# Altium project Pleiades_P01.PrjPcb (part 1 of 10)
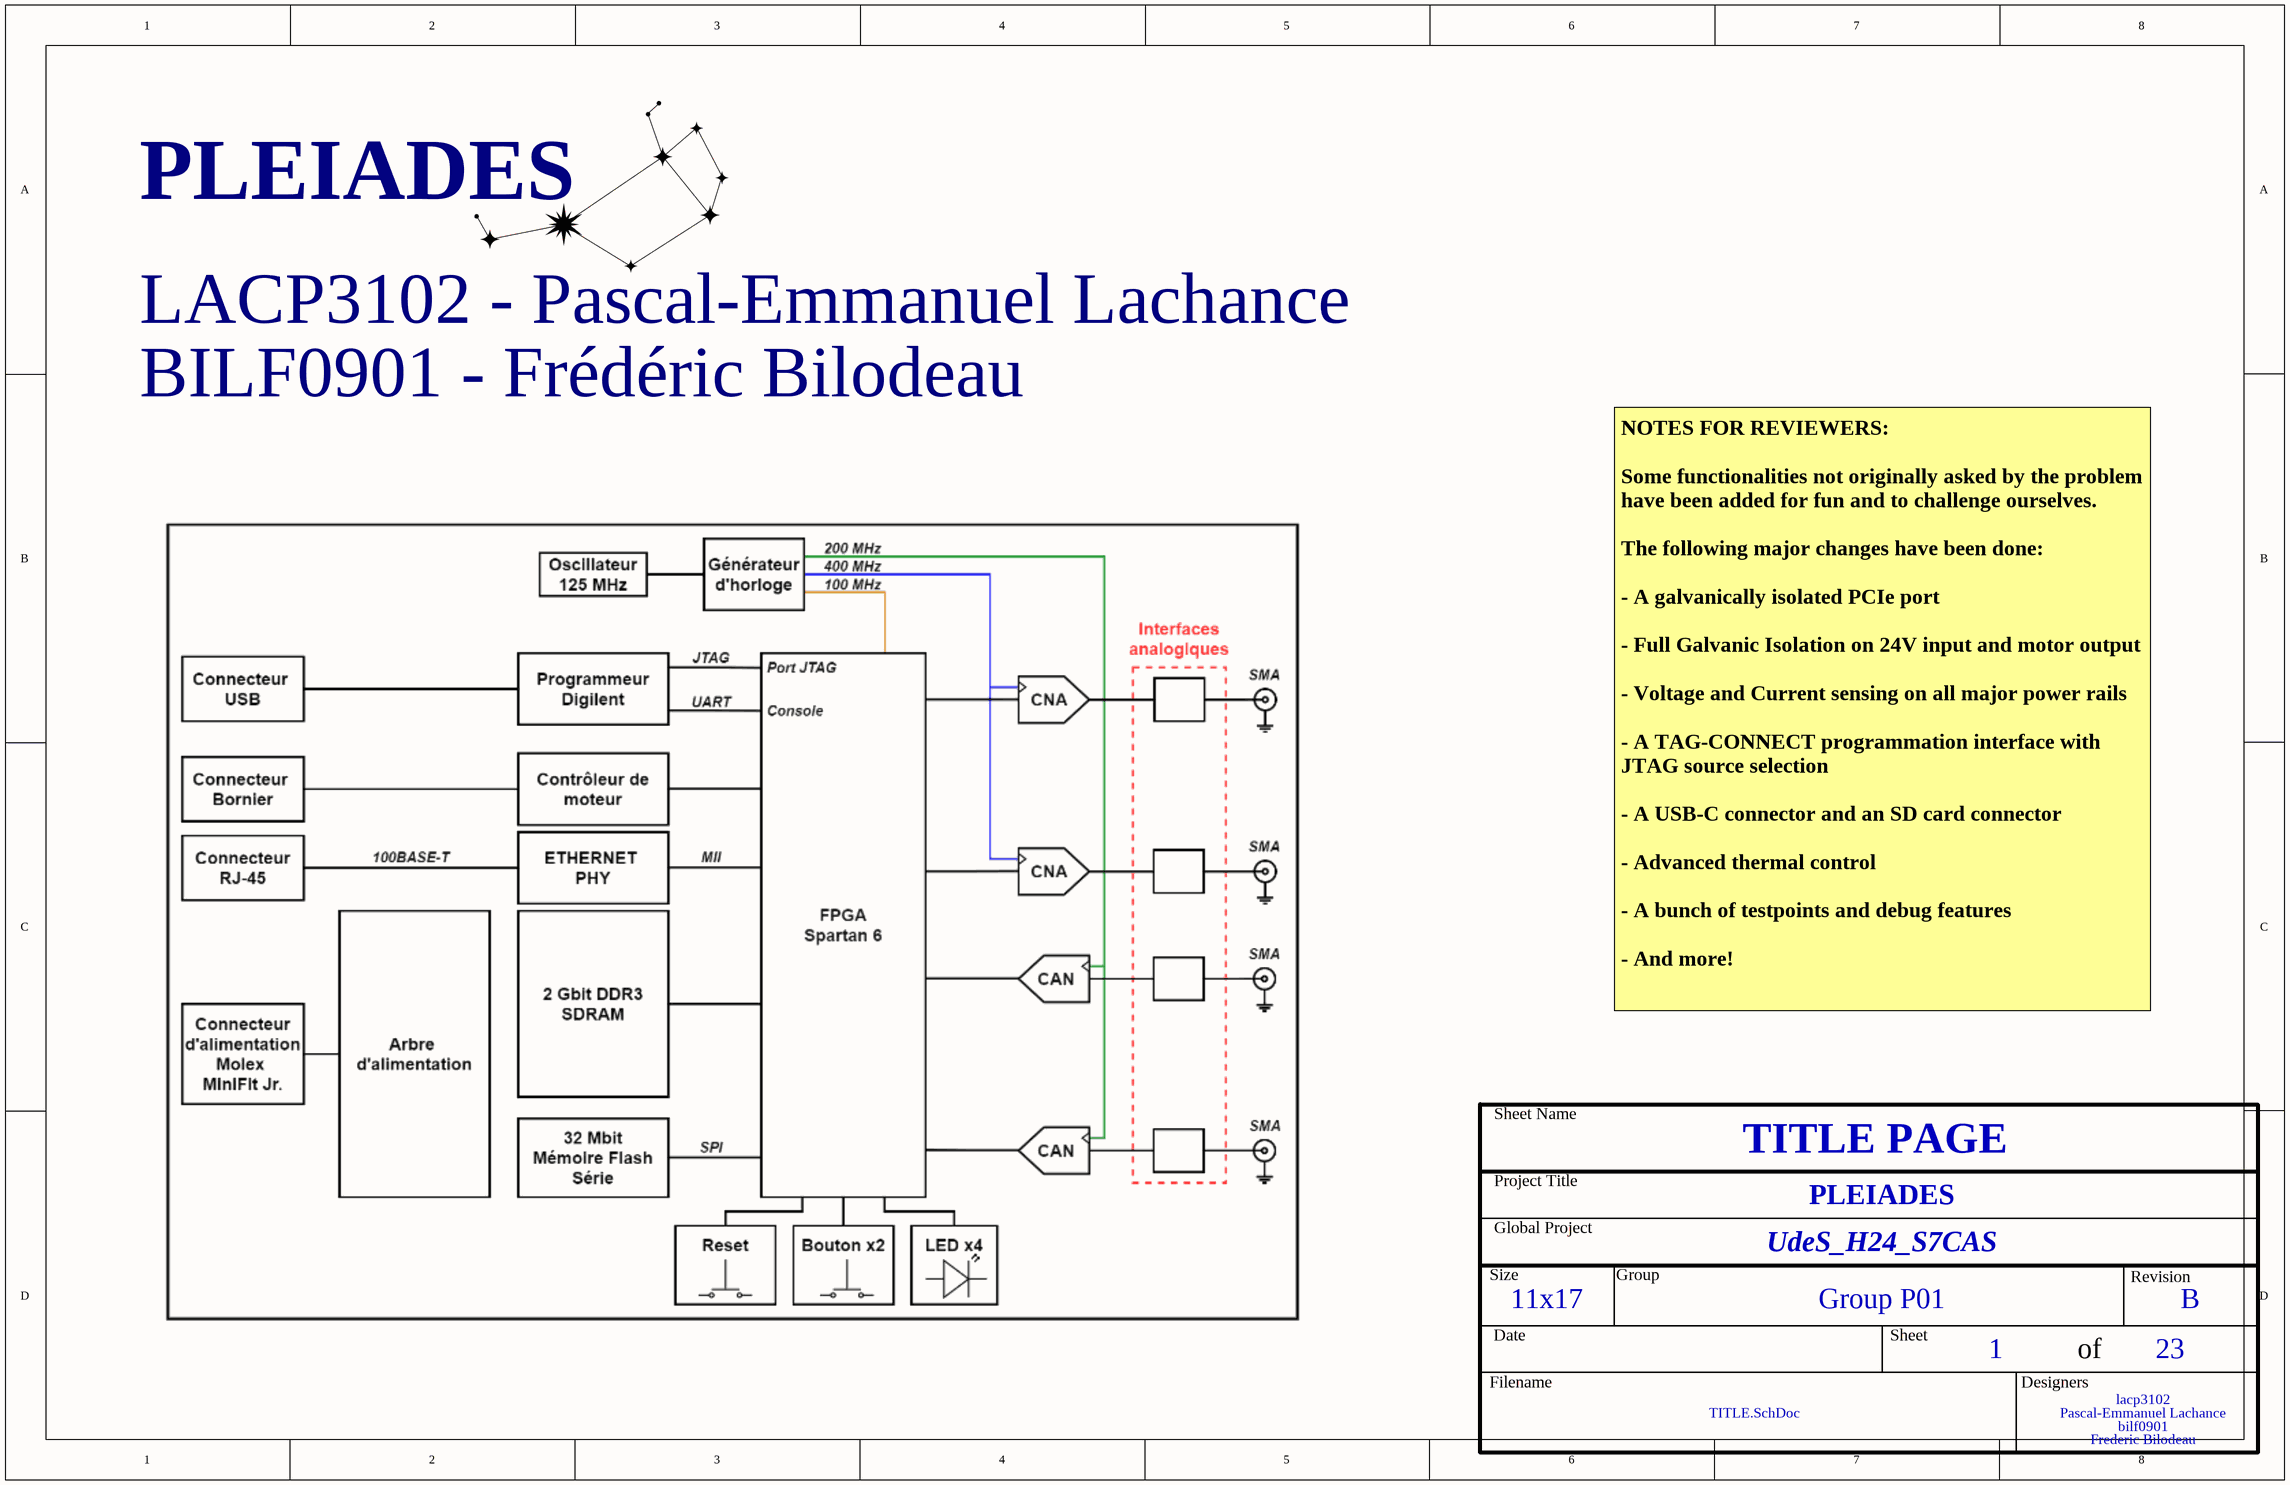
[diagram p0: TITLE.SchDoc]
Author: Pascal-Emmanuel Lachance; DOC_NO_ASSY_DWG: PCB_S7_DWG.PCBDwf; DOC_NO_BOM: PCB_S7_BOM.xslx; NotFitted: DNF; PCB_DWG_NO: PCB_S7.PcbDoc; Project: PLEIADES; Project_Date: =CurrentDate; Project_Designer1: lacp3102; Project_Designer2: Pascal-Emmanuel Lachance; Project_Designer3: bilf0901; Project_Designer4: Frederic Bilodeau; Project_Global: UdeS_H24_S7CAS; Project_Group: Group P01; Project_Name: PLEIADES; Project_Revision: B; Revision: B; SCH_SCALE: 1:1
25 sheets, 1537 parts. Net scope: hierarchical (ports join the sheet entries above them; power ports are global).
Board files: Pleiades_Frouf.PcbDoc, Pleiades_PP.PcbDoc
Sheets:
  TITLE.SchDoc
    Designator = INFO.SchDoc
    Designator = OVERVIEW.SchDoc
      MECHANICAL = MECHANICAL.SchDoc
      DDR3 = DDR3.SchDoc
      POWER = POWER.SchDoc
        POWER INPUT = POWER_INPUT.SchDoc
        FPGA POWER = POWER_FPGA.SchDoc
        DDR3 POWER = POWER_DDR3.SchDoc
        ANALOG POWER = POWER_ANALOG.SchDoc
        MOTOR POWER = POWER_MOTORS.SchDoc
        POWER_SENSING = POWER_SENSING.SchDoc
      PROM FLASH = PROM.SchDoc
      ADC = ADC.SchDoc
      DAC = DAC.SchDoc
      FPGA Misc = FPGA_MISC.SchDoc
      FPGA IOs = FPGA_IO.SchDoc
      MOTOR CONTROL = MOTOR_CONTROL.SchDoc
      USER IOs = USER_IO.SchDoc
      CLOCK = CLOCK.SchDoc
      USB = USB.SchDoc
      Ethernet = ETHERNET.SchDoc
      PCI = PCI.SchDoc
      SENSORS = SENSORS.SchDoc
      JTAG = JTAG.SchDoc

## Sheet TITLE.SchDoc
size Tabloid; SheetNumber: 1; SheetTotal: 23; Sheet_Name: TITLE PAGE; Size: 11x17

### Sub-sheets
Designator = INFO.SchDoc: no entries
Designator = OVERVIEW.SchDoc: no entries

### Notes on the sheet
- LACP3102 - Pascal-Emmanuel Lachance
- BILF0901 - Frédéric Bilodeau
- NOTES FOR REVIEWERS:
  Some functionalities not originally asked by the problem have been added for fun and to challenge ourselves.
  The following major changes have been done:
  - A galvanically isolated PCIe port
  - Full Galvanic Isolation on 24V input and motor output
  - Voltage and Current sensing on all major power rails
  - A TAG-CONNECT programmation interface with JTAG source selection
  - A USB-C connector and an SD card connector
  - Advanced thermal control
  - A bunch of testpoints and debug features
  - And more!
- Sheet Name
- Project Title
- Global Project
- Size
- Group
- Revision
- Date
- Sheet
- of
- Filename
- Designers

## Sheet INFO.SchDoc
size 558 x 431 mm; SheetNumber: 2; SheetTotal: 25; Sheet_Name: INFO; Size: 11x17
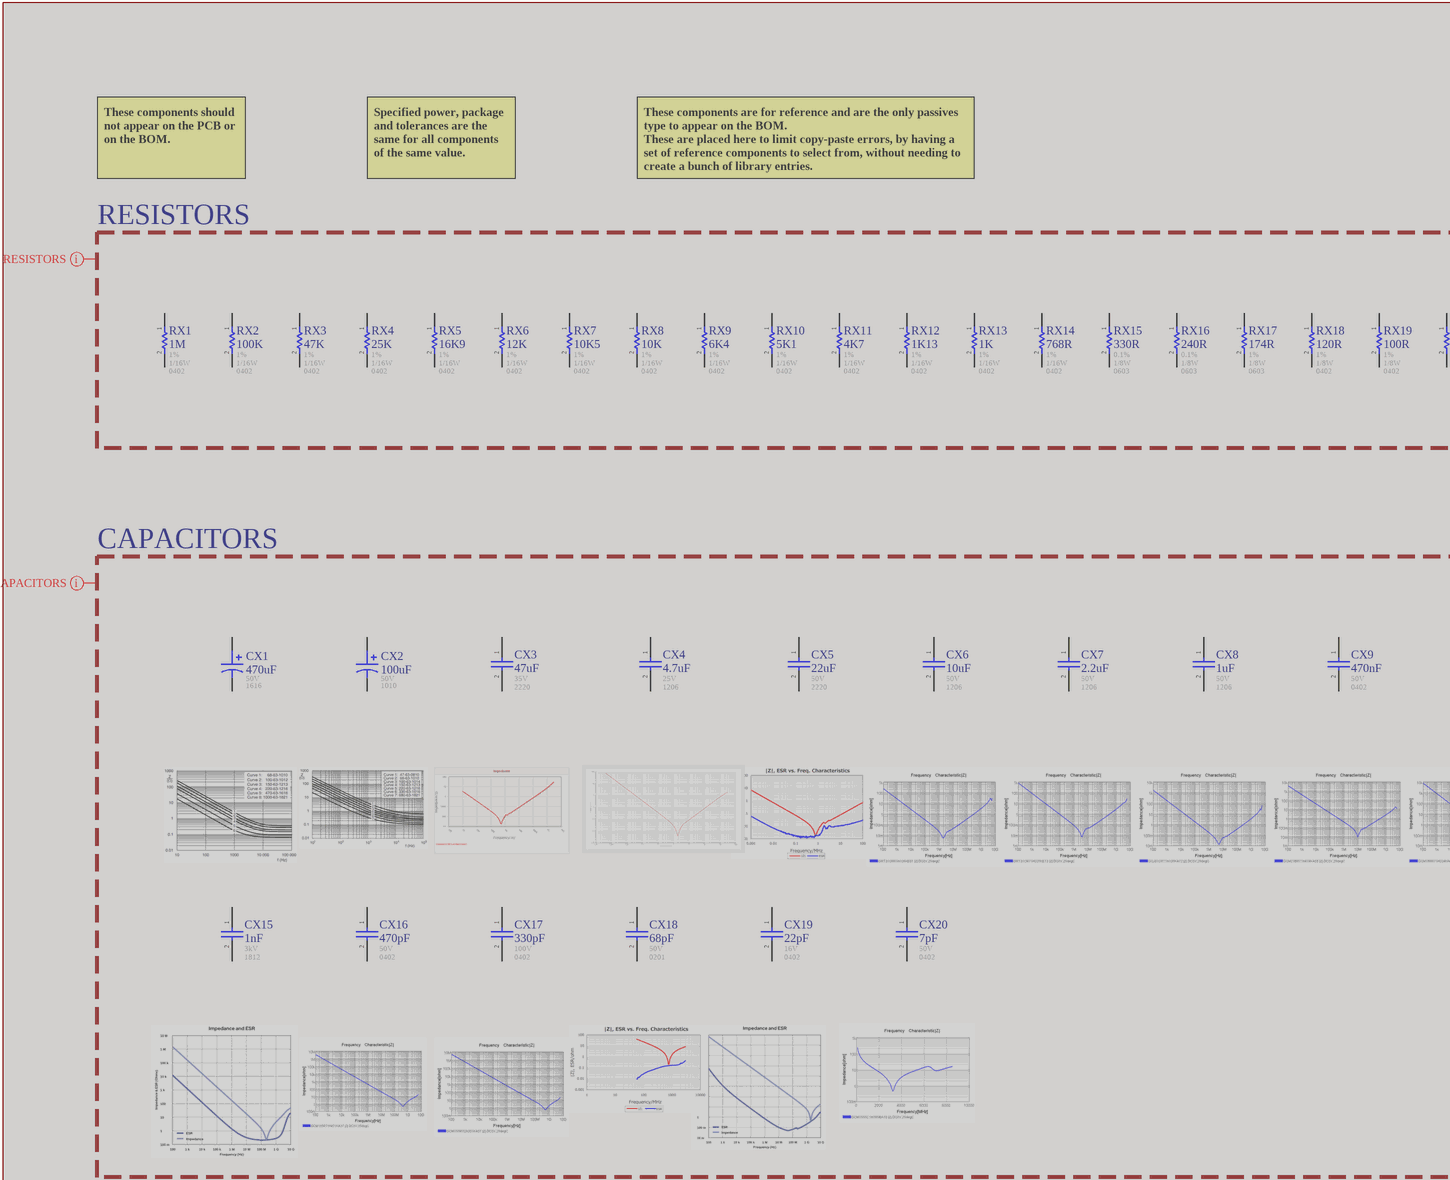
[diagram p1: INFO.SchDoc, top left]
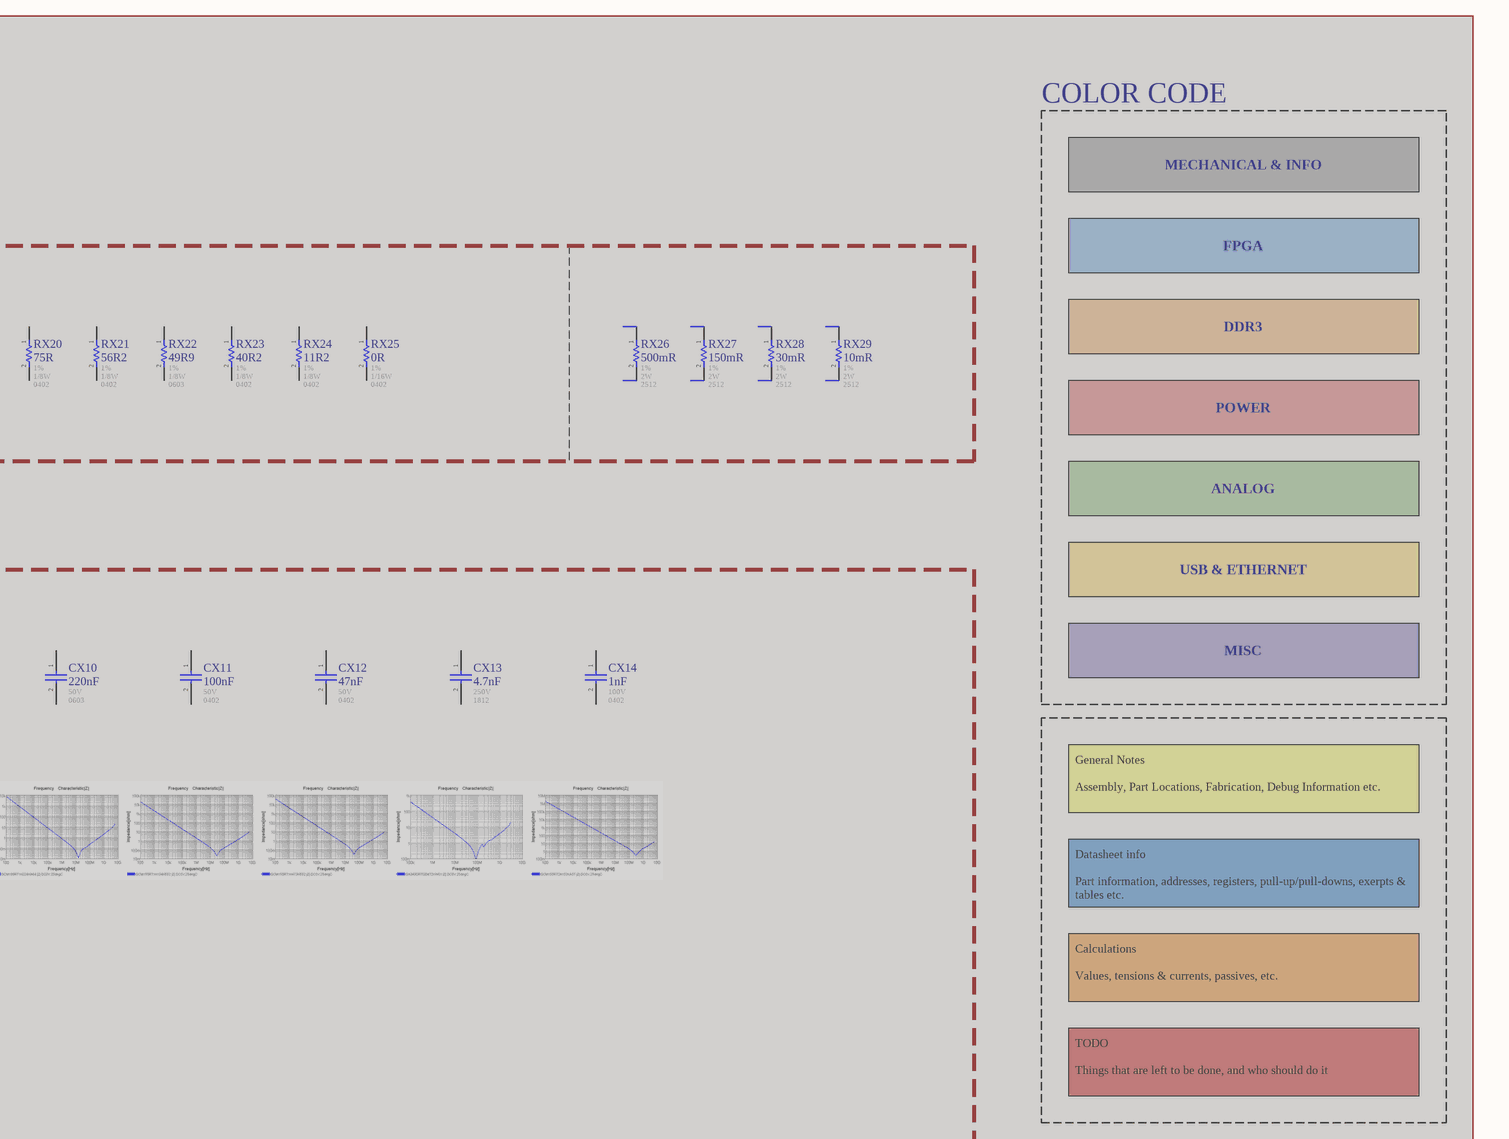
[diagram p2: INFO.SchDoc, top right]
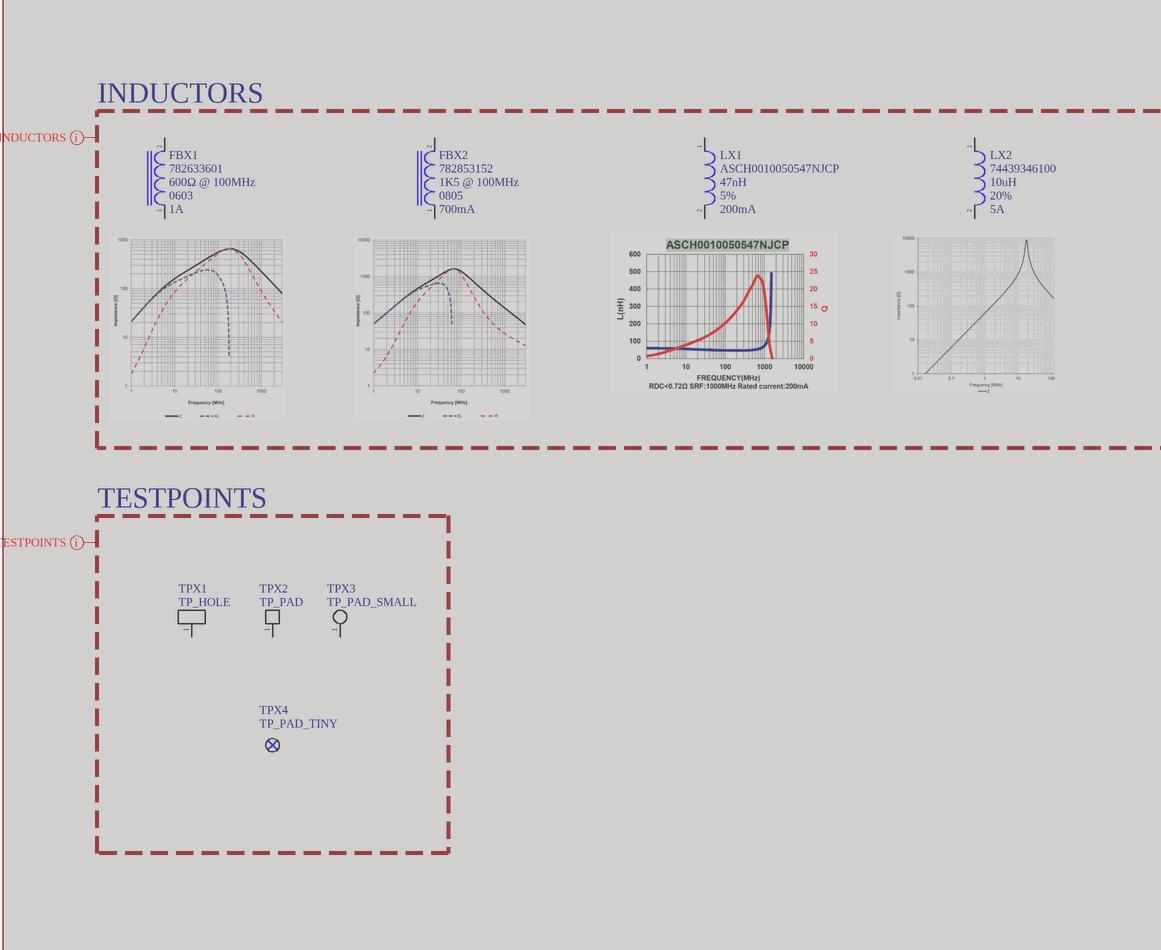
[diagram p3: INFO.SchDoc, bottom left]
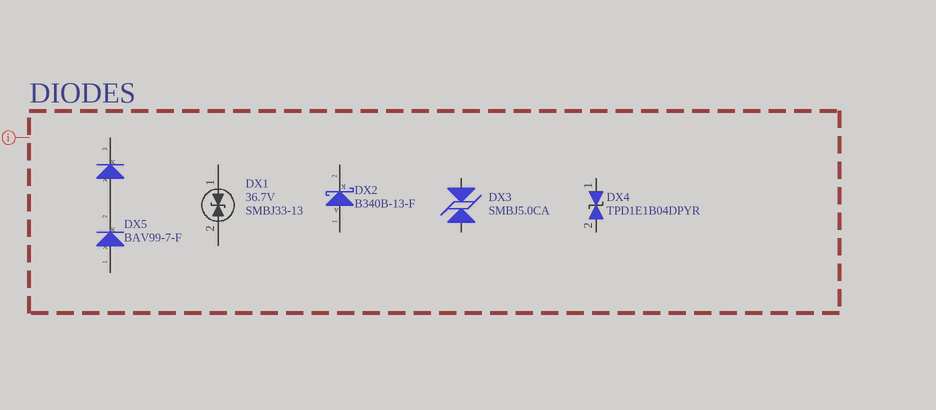
[diagram p4: INFO.SchDoc, bottom right]

### Parts
CX1  value 470uF  Voltage: 50V  Package: 1616  [CAP_ALU_1616_vishay]  (hidden comment: MAL214699108E3)  (masked out: inside a compile mask, not in the netlist)
CX2  value 100uF  Voltage: 50V  Package: 1010  [CAP_ALU_1010_vishay]  (hidden comment: MAL215099101E3)  (masked out: inside a compile mask, not in the netlist)
CX3  47uF  Voltage - Rated: 35V  Footprint: 2220  [CAP_2220]  (masked out: inside a compile mask, not in the netlist)
CX4  4.7uF  Voltage - Rated: 25V  Footprint: 1206  [CAP_1206]  (masked out: inside a compile mask, not in the netlist)
CX5  22uF  Voltage - Rated: 50V  Footprint: 2220  [CAP_2220]  (masked out: inside a compile mask, not in the netlist)
CX6  10uF  Voltage - Rated: 50V  Footprint: 1206  [CAP_1206]  (masked out: inside a compile mask, not in the netlist)
CX7  2.2uF  Voltage - Rated: 50V  Footprint: 1206  [CAP_1206]  (masked out: inside a compile mask, not in the netlist)
CX8  1uF  Voltage - Rated: 50V  Footprint: 1206  [CAP_1206]  (masked out: inside a compile mask, not in the netlist)
CX9  470nF  Voltage - Rated: 50V  Footprint: 0402  [CAP_0402]  (masked out: inside a compile mask, not in the netlist)
CX10  220nF  Voltage - Rated: 50V  Footprint: 0603  [CAP_0603]  (masked out: inside a compile mask, not in the netlist)
CX11  100nF  Voltage - Rated: 50V  Footprint: 0402  [CAP_0402]  (masked out: inside a compile mask, not in the netlist)
CX12  47nF  Voltage - Rated: 50V  Footprint: 0402  [CAP_0402]  (masked out: inside a compile mask, not in the netlist)
CX13  4.7nF  Voltage - Rated: 250V  Footprint: 1812  [CAP_1812]  (masked out: inside a compile mask, not in the netlist)
CX14  1nF  Voltage - Rated: 100V  Footprint: 0402  [CAP_0402]  (masked out: inside a compile mask, not in the netlist)
CX15  1nF  Voltage - Rated: 3kV  Footprint: 1812  [CAP_1812]  (masked out: inside a compile mask, not in the netlist)
CX16  470pF  Voltage - Rated: 50V  Footprint: 0402  [CAP_0402]  (masked out: inside a compile mask, not in the netlist)
CX17  330pF  Voltage - Rated: 100V  Footprint: 0402  [CAP_0402]  (masked out: inside a compile mask, not in the netlist)
CX18  68pF  Voltage - Rated: 50V  Footprint: 0201  [CAP_0402]  (masked out: inside a compile mask, not in the netlist)
CX19  22pF  Voltage - Rated: 16V  Footprint: 0402  [CAP_0402]  (masked out: inside a compile mask, not in the netlist)
CX20  7pF  Voltage - Rated: 50V  Footprint: 0402  [CAP_0402]  (masked out: inside a compile mask, not in the netlist)
DX1  SMBJ33-13  Voltage - Breakdown: 36.7V  [DO214AA (SMB)]  (masked out: inside a compile mask, not in the netlist)
DX2  B340B-13-F  [DO214AA (SMB)]  (masked out: inside a compile mask, not in the netlist)
DX3  SMBJ5.0CA  [TVS_PWR_SMBJ5.0CA]  (masked out: inside a compile mask, not in the netlist)
DX4  TPD1E1B04DPYR  [TVS_DATA_TPD1E1B04DPYR]  (masked out: inside a compile mask, not in the netlist)
DX5  BAV99-7-F  [SOT23-3]  (masked out: inside a compile mask, not in the netlist)
FBX1  782633601  Impedance @ Freq: 600Ω @ 100MHz  Package / Case: 0603  Current Rating: 1A  [IND_0603]  (masked out: inside a compile mask, not in the netlist)
FBX2  782853152  Impedance @ Freq: 1K5 @ 100MHz  Package / Case: 0805  Current Rating: 700mA  [IND_0805]  (masked out: inside a compile mask, not in the netlist)
LX1  ASCH0010050547NJCP  Inductance: 47nH  Tolerance: 5%  Current Rating: 200mA  [IND_0402]  (masked out: inside a compile mask, not in the netlist)
LX2  74439346100  Inductance: 10uH  Tolerance: 20%  Current Rating: 5A  [74439346100]  (masked out: inside a compile mask, not in the netlist)
NT30  Net Tie  [NETTIE_20]  (value not drawn)  (net tie, no BOM)  (masked out: inside a compile mask, not in the netlist)
NT31  Net Tie  [NETTIE_20]  (value not drawn)  (net tie, no BOM)  (masked out: inside a compile mask, not in the netlist)
NT32  Net Tie  [NETTIE_20]  (value not drawn)  (net tie, no BOM)  (masked out: inside a compile mask, not in the netlist)
NT33  Net Tie  [NETTIE_20]  (value not drawn)  (net tie, no BOM)  (masked out: inside a compile mask, not in the netlist)
NT34  Net Tie  [NETTIE_20]  (value not drawn)  (net tie, no BOM)  (masked out: inside a compile mask, not in the netlist)
NT35  Net Tie  [NETTIE_20]  (value not drawn)  (net tie, no BOM)  (masked out: inside a compile mask, not in the netlist)
NT36  Net Tie  [NETTIE_20]  (value not drawn)  (net tie, no BOM)  (masked out: inside a compile mask, not in the netlist)
NT37  Net Tie  [NETTIE_20]  (value not drawn)  (net tie, no BOM)  (masked out: inside a compile mask, not in the netlist)
RX1  1M  Tolerance: 1%  Power: 1/16W  Package / Case: 0402  [RES_0402]  (masked out: inside a compile mask, not in the netlist)
RX2  100K  Tolerance: 1%  Power: 1/16W  Package / Case: 0402  [RES_0402]  (masked out: inside a compile mask, not in the netlist)
RX3  47K  Tolerance: 1%  Power: 1/16W  Package / Case: 0402  [RES_0402]  (masked out: inside a compile mask, not in the netlist)
RX4  25K  Tolerance: 1%  Power: 1/16W  Package / Case: 0402  [RES_0402]  (masked out: inside a compile mask, not in the netlist)
RX5  16K9  Tolerance: 1%  Power: 1/16W  Package / Case: 0402  [RES_0402]  (masked out: inside a compile mask, not in the netlist)
RX6  12K  Tolerance: 1%  Power: 1/16W  Package / Case: 0402  [RES_0402]  (masked out: inside a compile mask, not in the netlist)
RX7  10K5  Tolerance: 1%  Power: 1/16W  Package / Case: 0402  [RES_0402]  (masked out: inside a compile mask, not in the netlist)
RX8  10K  Tolerance: 1%  Power: 1/16W  Package / Case: 0402  [RES_0402]  (masked out: inside a compile mask, not in the netlist)
RX9  6K4  Tolerance: 1%  Power: 1/16W  Package / Case: 0402  [RES_0402]  (masked out: inside a compile mask, not in the netlist)
RX10  5K1  Tolerance: 1%  Power: 1/16W  Package / Case: 0402  [RES_0402]  (masked out: inside a compile mask, not in the netlist)
RX11  4K7  Tolerance: 1%  Power: 1/16W  Package / Case: 0402  [RES_0402]  (masked out: inside a compile mask, not in the netlist)
RX12  1K13  Tolerance: 1%  Power: 1/16W  Package / Case: 0402  [RES_0402]  (masked out: inside a compile mask, not in the netlist)
RX13  1K  Tolerance: 1%  Power: 1/16W  Package / Case: 0402  [RES_0402]  (masked out: inside a compile mask, not in the netlist)
RX14  768R  Tolerance: 1%  Power: 1/16W  Package / Case: 0402  [RES_0402]  (masked out: inside a compile mask, not in the netlist)
RX15  330R  Tolerance: 0.1%  Power: 1/8W  Package / Case: 0603  [RES_0603]  (masked out: inside a compile mask, not in the netlist)
RX16  240R  Tolerance: 0.1%  Power: 1/8W  Package / Case: 0603  [RES_0603]  (masked out: inside a compile mask, not in the netlist)
RX17  174R  Tolerance: 1%  Power: 1/8W  Package / Case: 0603  [RES_0603]  (masked out: inside a compile mask, not in the netlist)
RX18  120R  Tolerance: 1%  Power: 1/8W  Package / Case: 0402  [RES_0402]  (masked out: inside a compile mask, not in the netlist)
RX19  100R  Tolerance: 1%  Power: 1/8W  Package / Case: 0402  [RES_0402]  (masked out: inside a compile mask, not in the netlist)
RX20  75R  Tolerance: 1%  Power: 1/8W  Package / Case: 0402  [RES_0402]  (masked out: inside a compile mask, not in the netlist)
RX21  56R2  Tolerance: 1%  Power: 1/8W  Package / Case: 0402  [RES_0402]  (masked out: inside a compile mask, not in the netlist)
RX22  49R9  Tolerance: 1%  Power: 1/8W  Package / Case: 0603  [RES_0603]  (masked out: inside a compile mask, not in the netlist)
RX23  40R2  Tolerance: 1%  Power: 1/8W  Package / Case: 0402  [RES_0402]  (masked out: inside a compile mask, not in the netlist)
RX24  11R2  Tolerance: 1%  Power: 1/8W  Package / Case: 0402  [RES_0402]  (masked out: inside a compile mask, not in the netlist)
RX25  0R  Tolerance: 1%  Power: 1/16W  Package / Case: 0402  [RES_0402]  (masked out: inside a compile mask, not in the netlist)
RX26  500mR  Tolerance: 1%  Power: 2W  Package / Case: 2512  [RES_2512]  (masked out: inside a compile mask, not in the netlist)
RX27  150mR  Tolerance: 1%  Power: 2W  Package / Case: 2512  [RES_2512]  (masked out: inside a compile mask, not in the netlist)
RX28  30mR  Tolerance: 1%  Power: 2W  Package / Case: 2512  [RES_2512]  (masked out: inside a compile mask, not in the netlist)
RX29  10mR  Tolerance: 1%  Power: 2W  Package / Case: 2512  [RES_2512]  (masked out: inside a compile mask, not in the netlist)
TPX1  TP_HOLE  [TP_HOLE]  (no BOM)  (masked out: inside a compile mask, not in the netlist)
TPX2  TP_PAD  [TP_PAD]  (no BOM)  (masked out: inside a compile mask, not in the netlist)
TPX3  TP_PAD_SMALL  [TP_PAD_SMALL]  (no BOM)  (masked out: inside a compile mask, not in the netlist)
TPX4  TP_PAD_TINY  [TP_PAD_TINY]  (no BOM)  (masked out: inside a compile mask, not in the netlist)

### Layout directives
CompClassName: DNF_PAGE: (no net found under the mark)

### Notes on the sheet
- COLOR CODE
- These components should not appear on the PCB or on the BOM.
- Specified power, package and tolerances are the same for all components of the same value.
- These components are for reference and are the only passives type to appear on the BOM.
  These are placed here to limit copy-paste errors, by having a set of reference components to select from, without needing to create a bunch of library entries.
- MECHANICAL & INFO
- RESISTORS
- FPGA
- DDR3
- POWER
- ANALOG
- CAPACITORS
- USB & ETHERNET
- MISC
- General Notes
  Assembly, Part Locations, Fabrication, Debug Information etc.
- Datasheet info
  Part information, addresses, registers, pull-up/pull-downs, exerpts & tables etc.
- Calculations
  Values, tensions & currents, passives, etc.
- TODO
  Things that are left to be done, and who should do it
- (near FBX1) INDUCTORS
- DIODES
- TESTPOINTS
- Sheet Name
- Project Title
- Global Project
- Revision
- Size
- Date
- Group
- Sheet
- of
- Filename
- Designers

### Library data of the parts
CX1 = CAP_ALU_MAL214699108E3: CAP - ALU 470uF 20% 50V - 1616; Current: 1.3A; Mfg: Vishay Dale; Mfg Part Number: MAL214699108E3; HelpURL: http://www.vishay.com/docs/28403/146cti.pdf; CreatedBy: Jonathan Bouchard; Temperature: -55°C to 125°C; Power: *; Supplier 1: Digikey; Supplier Part Number 1: 4442PHCT-ND; Precision: 20%
CX2 = CAP_ALU_MAL215099101E3: CAP - ALU 100uF 20% 50V - 1010; Current: 490mA; Mfg: Vishay Dale; Mfg Part Number: MAL215099101E3; HelpURL: http://www.vishay.com/docs/28395/150crz.pdf; CreatedBy: Jonathan Bouchard; Temperature: -55°C to 125°C; Power: *; Supplier 1: Digikey; Supplier Part Number 1: 4399PHDKR-ND; Precision: 20%
CX3 = CAP_CER: CGA9N1X7R1V476M230KC / 2220 47uF 20% X7R Ceramic Capacitor; Mfr: TDK; Operating Temperature: -55C - 125C; Temperature Coefficient: X7R; ComponentLink1Description: Digikey; ComponentLink1URL: https://www.digikey.ca/en/products/detail/tdk-corporation/CGA9N1X7R1V476M230KC/15930202; ComponentLink2Description: Datasheet; ComponentLink2URL: https://product.tdk.com/system/files/dam/doc/product/capacitor/ceramic/mlcc/catalog/mlcc_automotive_general_en.pdf; Tolerance: 20%; Ratings: AEC-Q200; Part#: CGA9N1X7R1V476M230KC; ComponentLink3Description: TDK; ComponentLink3URL: https://product.tdk.com/en/search/capacitor/ceramic/mlcc/info?part_no=CGA9N1X7R1V476M230KC; ComponentLink4Description: Octopart; ComponentLink4URL: https://octopart.com/cga9n1x7r1v476m230kc-tdk-122377816?r=sp; Supplier 1: Newark; Supplier Part Number 1: 57AK9414
CX4 = CAP_CER: CGA8L2X7R1E475M160KA / 1812 4.7uF 20% X7R Ceramic Capacitor; Mfr: TDK; Part#: CGA9N1X7R1V476M230KC; Operating Temperature: -55C - 125C; Temperature Coefficient: X7R; ComponentLink1Description: Digikey; ComponentLink1URL: https://www.digikey.ca/en/products/detail/tdk-corporation/CGA9N1X7R1V476M230KC/15930202; ComponentLink2Description: Datasheet; ComponentLink2URL: https://product.tdk.com/system/files/dam/doc/product/capacitor/ceramic/mlcc/catalog/mlcc_automotive_general_en.pdf; Tolerance: 20%; Ratings: AEC-Q200; ComponentLink3Description: TDK; ComponentLink3URL: https://product.tdk.com/en/search/capacitor/ceramic/mlcc/info?part_no=CGA9N1X7R1V476M230KC; ComponentLink4Description: Octopart; ComponentLink4URL: https://octopart.com/cga9n1x7r1v476m230kc-tdk-122377816?r=sp; Supplier 1: Newark; Supplier Part Number 1: 57AK9414
CX5 = CAP_CER: CGA9P3X7R1H226M250KB / 2220 22uF 20% X7R Ceramic Capacitor; Mfr: TDK; Operating Temperature: -55C - 125C; Temperature Coefficient: X7R; ComponentLink1Description: Digikey; ComponentLink1URL: https://www.digikey.ca/en/products/detail/tdk-corporation/CGA9P3X7R1H226M250KB/10240627; ComponentLink2Description: Datasheet; ComponentLink2URL: https://product.tdk.com/system/files/dam/doc/product/capacitor/ceramic/mlcc/charasheet/cga9p3x7r1h226m250kb.pdf; Tolerance: 20%; Ratings: AEC-Q200; Part#: CGA9P3X7R1H226M250KB; Supplier 1: Arrow Electronics; Supplier Part Number 1: CGA9P3X7R1H226M250KB; ComponentLink3Description: TDK; ComponentLink3URL: https://product.tdk.com/en/search/capacitor/ceramic/mlcc/info?part_no=CGA9P3X7R1H226M250KB; ComponentLink4Description: Octopart; ComponentLink4URL: https://octopart.com/cga9p3x7r1h226m250kb-tdk-102764996?r=sp
CX6 = CAP_CER: GRT31CR61H106KE01L / 1206 10uF 10% X5R Ceramic Capacitor; Mfr: Murata; Operating Temperature: -55C - 85C; Temperature Coefficient: X5R; ComponentLink1Description: Digikey; ComponentLink1URL: [Digikey Link]; ComponentLink2Description: Datasheet; ComponentLink2URL: [Datasheet Link]; Tolerance: 10%; Ratings: AEC-Q200; Supplier 1: Arrow Electronics; Supplier Part Number 1: GRT31CR61H106KE01L; Part#: GRT31CR61H106KE01L
CX7 = CAP_CER: GRT31CR71H225KE13L / 1206 2.2uF 10% X7R Ceramic Capacitor; Mfr: Murata; Operating Temperature: -55C - 125C; Temperature Coefficient: X7R; ComponentLink1Description: Digikey; ComponentLink1URL: https://www.digikey.ca/en/products/detail/murata-electronics/GRT31CR71H225KE13L/10700891; Part#: GRT31CR71H225KE13L; ComponentLink2Description: Datasheet; ComponentLink2URL: https://search.murata.co.jp/Ceramy/image/img/A01X/G101/ENG/GRT31CR71H225KE13-01A.pdf; ComponentLink3Description: Octopart; ComponentLink3URL: https://octopart.com/grt31cr71h225ke13l-murata-76584457?r=sp; ComponentLink4Description: Murata; ComponentLink4URL: https://www.murata.com/en-us/products/productdetail?partno=GRT31CR71H225KE13%23; Tolerance: 10%; Ratings: AEC-Q200
CX8 = CAP_CER: GCJ31CR71H105KA12L / 1206 1uF 10% X7R Ceramic Capacitor; Mfr: Murata; Operating Temperature: -55C - 125C; Temperature Coefficient: X7R; ComponentLink1Description: Digikey; ComponentLink1URL: [Digikey Link]; Part#: GCJ31CR71H105KA12L; ComponentLink2Description: Datasheet; ComponentLink2URL: [Datasheet Link]; Tolerance: 10%; Ratings: AEC-Q200
CX9 = CAP_CER: CGA3E3X7R1H474K080AB / 0603 470nF 10% X7R Ceramic Capacitor; Mfr: TDK; Operating Temperature: -55C - 125C; Temperature Coefficient: X7R; ComponentLink1Description: Digikey; ComponentLink1URL: [Digikey Link]; Part#: CGA3E3X7R1H474K080AB; ComponentLink2Description: Datasheet; ComponentLink2URL: [Datasheet Link]; Tolerance: 10%; Ratings: AEC-Q200
CX10 = CAP_CER: GCM188R71H224KA64D / 0603 220nF 10% X7R Ceramic Capacitor; Mfr: Murata; Operating Temperature: -55C - 125C; Temperature Coefficient: X7R; ComponentLink1Description: Digikey; ComponentLink1URL: [Digikey Link]; Part#: GCM188R71H224KA64D; ComponentLink2Description: Datasheet; ComponentLink2URL: [Datasheet Link]; Tolerance: 10%; Ratings: AEC-Q200
CX11 = CAP_CER: GCM155R71H104KE02J / 0402 100nF 10% X7R Ceramic Capacitor; Mfr: Murata; Operating Temperature: -55C - 125C; Temperature Coefficient: X7R; ComponentLink1Description: Digikey; ComponentLink1URL: [Digikey Link]; Part#: GCM155R71H104KE02J; ComponentLink2Description: Datasheet; ComponentLink2URL: [Datasheet Link]; Tolerance: 10%; Ratings: AEC-Q200
CX12 = CAP_CER: GCM155R71H473KE02J / 0402 47nF 10% X7R Ceramic Capacitor; Mfr: Murata; Operating Temperature: -55C - 125C; Temperature Coefficient: X7R; ComponentLink1Description: Digikey; ComponentLink1URL: [Digikey Link]; Part#: GCM155R71H473KE02J; ComponentLink2Description: Datasheet; ComponentLink2URL: [Datasheet Link]; Tolerance: 10%; Ratings: AEC-Q200
CX13 = CAP_CER: GA343DR7GD472KW01L / 0402 4.7nF 10% X7R 1812 250VAC Ceramic Capacitor; Mfr: Murata; Ratings: Y3 - Safety; Operating Temperature: -55C - 125C; Temperature Coefficient: X7R; ComponentLink1Description: Digikey; ComponentLink1URL: https://www.digikey.ca/en/products/detail/murata-electronics/GA343DR7GD472KW01L/789292; ComponentLink2Description: Datasheet; ComponentLink2URL: https://search.murata.co.jp/Ceramy/image/img/A01X/G101/ENG/GA343DR7GD472KW01-01.pdf; ComponentLink3Description: Octopart; ComponentLink3URL: https://octopart.com/ga343dr7gd472kw01l-murata-197048?r=sp; Tolerance: 10%; Part#: GA343DR7GD472KW01L; ComponentLink4Description: Murata; ComponentLink4URL: https://www.murata.com/en-us/products/productdetail?partno=GA343DR7GD472KW01%23
CX14 = CAP_CER: GCM155R72A102KA37D / 0402 1nF 10% X7R Ceramic Capacitor; Mfr: Murata; Operating Temperature: -55C - 125C; Temperature Coefficient: X7R; ComponentLink1Description: Digikey; ComponentLink1URL: [Digikey Link]; Part#: GCM155R72A102KA37D; ComponentLink2Description: Datasheet; ComponentLink2URL: [Datasheet Link]; Tolerance: 10%; Ratings: AEC-Q200
CX15 = CAP_CER: C1812C102KHRACAUTO / 0402 470pF 10% X7R Ceramic Capacitor; Mfr: KEMET; Operating Temperature: -55C - 125C; Temperature Coefficient: X7R; ComponentLink1Description: Digikey; ComponentLink1URL: https://www.digikey.com/en/products/detail/kemet/C1812C102KHRACAUTO/8109956; Part#: C1812C102KHRACAUTO; ComponentLink2Description: Datasheet; ComponentLink2URL: https://connect.kemet.com:7667/gateway/IntelliData-ComponentDocumentation/1.0/download/datasheet/C1812C102KHRACAUTO; Tolerance: 10%; Ratings: AEC-Q200; ComponentLink3Description: KEMET; ComponentLink3URL: https://www.kemet.com/en/us/capacitors/ceramic/product/C1812C102KHRACAUTO.html; ComponentLink4Description: Octopart; ComponentLink4URL: https://octopart.com/c1812c102khracauto-kemet-67309371?r=sp; Features: Low ESL, High Voltage; Supplier 1: Mouser; Supplier Part Number 1: 80-C1812C102KHRAUTO
CX16 = CAP_CER: GCM155R71H471KA37J / 0402 470pF 10% X7R Ceramic Capacitor; Mfr: Murata; Operating Temperature: -55C - 125C; Temperature Coefficient: X7R; ComponentLink1Description: Digikey; ComponentLink1URL: https://www.digikey.ca/en/products/detail/murata-electronics/GCM155R71H471KA37J/2591324; Part#: GCM155R71H471KA37J; ComponentLink2Description: Datasheet; ComponentLink2URL: https://search.murata.co.jp/Ceramy/image/img/A01X/G101/ENG/GCM155R71H471KA37-01A.pdf; Tolerance: 10%; Ratings: AEC-Q200; ComponentLink3Description: Murata; ComponentLink3URL: https://www.murata.com/en-us/products/productdetail?partno=GCM155R71H471KA37%23; ComponentLink4Description: Octopart; ComponentLink4URL: https://octopart.com/gcm155r71h471ka37j-murata-17803389?r=sp
CX17 = CAP_CER: GCM155R72A331KA37D / 0402 330pF 10% X7R Ceramic Capacitor; Mfr: Murata; Operating Temperature: -55C - 125C; Temperature Coefficient: X7R; ComponentLink1Description: Digikey; ComponentLink1URL: https://www.digikey.ca/en/products/detail/murata-electronics/GCM155R72A331KA37D/2591348; Part#: GCM155R72A331KA37D; ComponentLink2Description: Datasheet; ComponentLink2URL: https://search.murata.co.jp/Ceramy/image/img/A01X/G101/ENG/GCM155R72A331KA37-01A.pdf; Tolerance: 10%; Ratings: AEC-Q200; ComponentLink3Description: Murata; ComponentLink3URL: https://www.murata.com/en-us/products/productdetail?partno=GCM155R72A331KA37%23; ComponentLink4Description: Octopart; ComponentLink4URL: https://octopart.com/gcm155r72a331ka37d-murata-18331888?r=sp; Supplier 1: Arrow Electronics; Supplier Part Number 1: GCM155R72A331KA37D
CX18 = CAP_CER: 0201 68pF 5% C0G 50V Ceramic Capacitor / CGA1A2C0G1H680J030BA; Mfr: TDK; Operating Temperature: -55C - 125C; Temperature Coefficient: C0G; ComponentLink1Description: Digikey; ComponentLink1URL: https://www.digikey.ca/en/products/detail/tdk-corporation/CGA1A2C0G1H680J030BA/3648597; Part#: CGA1A2C0G1H680J030BA; ComponentLink2Description: Datasheet; ComponentLink2URL: https://product.tdk.com/system/files/dam/doc/product/capacitor/ceramic/mlcc/charasheet/cga1a2c0g1h680j030ba.pdf; Tolerance: 5%; Ratings: AEC-Q200; ComponentLink3Description: Octopart; ComponentLink3URL: https://octopart.com/cga1a2c0g1h680j030ba-tdk-26014371?r=sp; ComponentLink4Description: TDK; ComponentLink4URL: https://product.tdk.com/en/search/capacitor/ceramic/mlcc/info?part_no=CGA1A2C0G1H680J030BA; Supplier 1: Arrow Electronics; Supplier Part Number 1: CGA1A2C0G1H680J030BA
CX19 = CAP_CER: 0402 22pF 10% X7R 16V Ceramic Capacitor / C0402C220K4RACAUTO; Mfr: KEMET; Operating Temperature: -55C - 125C; Temperature Coefficient: X7R; ComponentLink1Description: Digikey; ComponentLink1URL: https://www.digikey.ca/en/products/detail/kemet/c0402c220k4racauto/11676432; Part#: C0402C220K4RACAUTO; ComponentLink2Description: Datasheet; ComponentLink2URL: https://connect.kemet.com:7667/gateway/IntelliData-ComponentDocumentation/1.0/download/datasheet/C0402C220K4RACAUTO; Tolerance: 10%; Ratings: AEC-Q200; ComponentLink3Description: Octopart; ComponentLink3URL: https://octopart.com/c0402c220k4racauto-kemet-91893749?r=sp; ComponentLink4Description: Kemet; ComponentLink4URL: https://www.kemet.com/en/us/capacitors/ceramic/product/C0402C220K4RACAUTO.html; ComponentLink5Description: Specsheet; ComponentLink5URL: https://search.kemet.com/component-documentation/download/specsheet/C0402C220K4RACAUTO; Supplier 1: Mouser; Supplier Part Number 1: 80-C0402C220K4RAUTO
CX20 = CAP_CER: 0402 7pF C0G Ceramic Capacitor / GCM1555C1H7R0BA16D; Mfr: Murata; Operating Temperature: -55C - 125C; Temperature Coefficient: C0G; ComponentLink1Description: Digikey; ComponentLink1URL: https://www.digikey.ca/en/products/detail/murata-electronics/GCM1555C1H7R0BA16D/11618476; ComponentLink2Description: Datasheet; ComponentLink2URL: https://search.murata.co.jp/Ceramy/image/img/A01X/G101/ENG/GCM1555C1H7R0BA16-01.pdf
DX1 = DIODE_TVS: 53.3V Clamp 11.3A Ipp Tvs Diode Surface Mount SMB; Mfr: SMBJ33CAQ-13-F; Voltage - Reverse: 33V; Operating Temperature: *; Package / Case: SMB; Current: 11.3A; ComponentLink1Description: Digikey; ComponentLink1URL: https://www.digikey.ca/en/products/detail/diodes-incorporated/SMBJ33CAQ-13-F/9738859
DX2 = DIODE_SHOTTKEY: VS-15MQ040HM3/5AT; Diode Type: Schottky; Current: 1.5A; Reverse Voltage: 40V; Forward Voltage: 430mV @ 1.5A; Qualification: AEC-Q101; Package / Case: SMA; ComponentLink1Description: Digikey; ComponentLink1URL: https://www.digikey.ca/en/products/detail/diodes-incorporated/B340B-13-F/768869; ComponentLink2Description: Octopart; ComponentLink2URL: https://octopart.com/b340b-13-f-diodes+inc.-325817?r=sp
DX3 = TVS_PWR_SMBJ5.0CA: TVS - BIDIR 5V 9.2V 600W - DO214AA; Manufacturer #1: Littelfuse Inc.; Value: Vbr = 6.4V -  Clamp = 9.2V; Voltage Rating: 5V Standoff; Current Rating: 65.3 A (Ipp); Power Max: 600W (Pppm); GRAMS Lib Spec: 2.8; Magnetic Material: UNKNOWN; Polarized: NO; Tolerance: *; HelpURL: http://www.littelfuse.com/~/media/electronics/datasheets/tvs_diodes/littelfuse_tvs_diode_smbj_datasheet.pdf.pdf; CreatedBy/Date: Jonathan Bouchard - 2019-03-22; VerifiedBy: Nicolas V. (2019-05-06); Temperature: -65°C ~ 150°C (TJ); Package: DO214AA; Manufacturer #2: *; Note: *; Assembly Type: SMD; Part Number #2: *; Part Number #1: SMBJ5.0CA; Supplier 1: Digi-Key; Supplier Part Number 1: SMBJ5.0CALFCT-ND; Cryo: UNKNOWN
DX4 = TVS_DATA_TPD1E1B04DPYR: TVS - TVS DIODE 3.6V 8.5V - 0402; Manufacturer #1: Texas Instruments; Current Rating: 6.3Apeak; Power Max: 50Wpeak; GRAMS Lib Spec: 2.8; Magnetic Material: Unknown; Polarized: No; Value: *; Tolerance: *; Voltage Rating: 3.6V; HelpURL: http://www.ti.com/lit/ds/symlink/tpd1e1b04.pdf; CreatedBy/Date: Keven Deslandes - 2018/10/19; VerifiedBy: Caroline Paulin - 28 janv 2019; Temperature: -40°C ~ 125°C (TA); Package: 0402; Manufacturer #2: *; Note: *; Assembly Type: SMD; Part Number #2: *; Part Number #1: TPD1E1B04DPYR; Supplier 1: Digi-Key; Supplier Part Number 1: 296-47364-1-ND; Cryo: UNKNOWN
DX5 = DIODE_TVS_DUAL: Diode Array 1 Pair Series Connection 75 V 300mA (DC) Surface Mount TO-236-3, SC-59, SOT-23-3; Mfr: Diodes Incorporated; Voltage - DC Reverse: 75V; Voltage - Forward: 1.25V @ 150mA; Reverse Recovery Time: 4ns; Capacitance: 2pF; Current - Reverse Leakage: 2.5µA @ 75V; Operating Temperature: -65C - 150C; Package / Case: SOT-23-3; Current: 300mA; ComponentLink1Description: Digikey; ComponentLink1URL: https://www.digikey.ca/en/products/detail/diodes-incorporated/BAV99-7-F/815018; ComponentLink2Description: Datasheet; ComponentLink2URL: https://www.diodes.com/assets/Datasheets/BAV99.pdf; ComponentLink3Description: Octopart; ComponentLink3URL: https://octopart.com/bav99-7-f-diodes+inc.-326328; Supplier 1: Future Electronics; Supplier Part Number 1: 3851920
FBX1 = FERRITE_BEAD: 600 Ohms @ 100 MHz 1 Signal Line Ferrite Bead 0603 (1608 Metric) 1A 200mOhm; Manufacturer: Wurth Elektronik; Resistance: 200mR; Operating Temperature: -55C - 125C; Rating: AEC-Q200; ComponentLink1Description: Digikey; ComponentLink1URL: https://www.digikey.ca/en/products/detail/w%C3%BCrth-elektronik/782633601/5168802; ComponentLink3Description: Octopart; ComponentLink3URL: https://octopart.com/782633601-wurth+elektronik-56466764; Supplier 1: Digikey; Supplier Part Number 1: 732-6703-1-ND; ComponentLink5Description: Datasheet; ComponentLink5URL: https://www.we-online.com/components/products/datasheet/782633601.pdf
FBX2 = FERRITE_BEAD: 600 Ohms @ 100 MHz 1 Signal Line Ferrite Bead 0603 (1608 Metric) 1A 200mOhm; Manufacturer: Wurth Elektronik; Resistance: 350mR; Operating Temperature: -55C - 125C; Rating: AEC-Q200; ComponentLink1Description: Digikey; ComponentLink1URL: https://www.digikey.ca/en/products/detail/w%C3%BCrth-elektronik/782853152/5168812; ComponentLink3Description: Octopart; ComponentLink3URL: https://octopart.com/782853152-wurth+elektronik-56466774?r=sp; ComponentLink5Description: Datasheet; ComponentLink5URL: https://www.we-online.com/en/components/products/datasheet/782853152.pdf
LX1 = INDUCTOR: Generic Inductor; Resistance: 2R; Q @ Freq: 8 @ 100MHz; Material: Ceramic; Operating Temperature: -40C - 125C; Package / Case: 0402; Ratings: AEC-Q200; ComponentLink1Description: Digikey; ComponentLink1URL: https://www.digikey.ca/en/products/detail/pulse-electronics/asch0010050547njcp/16505828; ComponentLink2Description: Datasheet; ComponentLink2URL: https://productfinder.pulseelectronics.com/api/open/part-attachments/datasheet/ASCH0010050547NJCP; ComponentLink3Description: Octopart; ComponentLink3URL: https://octopart.com/asch0010050547njcp-pulse-128075783?r=sp; Supplier 1: Mouser; Supplier Part Number 1: 673-ASCH10050547NJCP
LX2 = INDUCTOR: Generic Inductor; Resistance: 25.5mR; Material: Metal Composite; Operating Temperature: -40C - 125C; Package / Case: Nonstandard; Ratings: AEC-Q200; Q @ Freq: -; ComponentLink1Description: Digikey; ComponentLink1URL: https://www.digikey.ca/en/products/detail/w%C3%BCrth-elektronik/74439346100/6236306; ComponentLink2Description: Datasheet; ComponentLink2URL: https://www.we-online.com/components/products/datasheet/74439346100.pdf; ComponentLink3Description: Octopart; ComponentLink3URL: https://octopart.com/74439346100-wurth+elektronik-75811204?r=sp; Supplier 1: Digikey; Supplier Part Number 1: 732-10707-1-ND
NT30-NT37 = NET_TIE_SMALL
RX1 = RESISTOR: 1M 0402 1% 1/16W Resistor; Automotive: AEC-Q200; Operating Temperature: *; # Digikey: *; ComponentLink1Description: Digikey; ComponentLink1URL: *; # Manufacturer: *
RX2-RX14 RX16-RX25 = RESISTOR: Automotive: AEC-Q200; Operating Temperature: *; # Digikey: *; ComponentLink1Description: Digikey; ComponentLink1URL: *; # Manufacturer: *
RX15 = RESISTOR: 1M 0603 1% 1/16W Resistor; Automotive: AEC-Q200; Operating Temperature: *; # Digikey: *; ComponentLink1Description: Digikey; ComponentLink1URL: *; # Manufacturer: *
RX26 = RESISTOR: Part #: CSRN2512FKR500; Automotive: AEC-Q200; Operating Temperature: -55C - 155C; ComponentLink1Description: Digikey; ComponentLink1URL: https://www.digikey.ca/fr/products/detail/stackpole-electronics-inc/CSRN2512FKR500/1742768
RX27 = RESISTOR: CSRN2512FKR150; Automotive: AEC-Q200; Operating Temperature: -55C - 155C; ComponentLink1Description: Digikey; ComponentLink1URL: https://www.digikey.ca/fr/products/detail/stackpole-electronics-inc/CSRN2512FKR150/1788109; Part #: CSRN2512FKR150
RX28 = RESISTOR: CSRN2512FK30L0; Automotive: AEC-Q200; Operating Temperature: -55C - 155C; ComponentLink1Description: Digikey; ComponentLink1URL: https://www.digikey.ca/fr/products/detail/stackpole-electronics-inc/CSRN2512FK30L0/1646107; Part #: CSRN2512FK30L0
RX29 = RESISTOR: CSRN2512FK10L0; Automotive: AEC-Q200; Operating Temperature: -55C - 155C; ComponentLink1Description: Digikey; ComponentLink1URL: https://www.digikey.ca/fr/products/detail/stackpole-electronics-inc/CSRN2512FK10L0/1646104; Part #: CSRN2512FK10L0
TPX1 = TESTPOINT_HOLE: Test Point
TPX2 = TESTPOINT_PAD: Test Point
TPX3 = TESTPOINT_PAD_SMALL: Test Point
TPX4 = TESTPOINT_PAD_TINY: Test Point

## Sheet OVERVIEW.SchDoc
size 558 x 431 mm; SheetNumber: 3; SheetTotal: 25; Sheet_Name: OVERVIEW; Size: 11x17
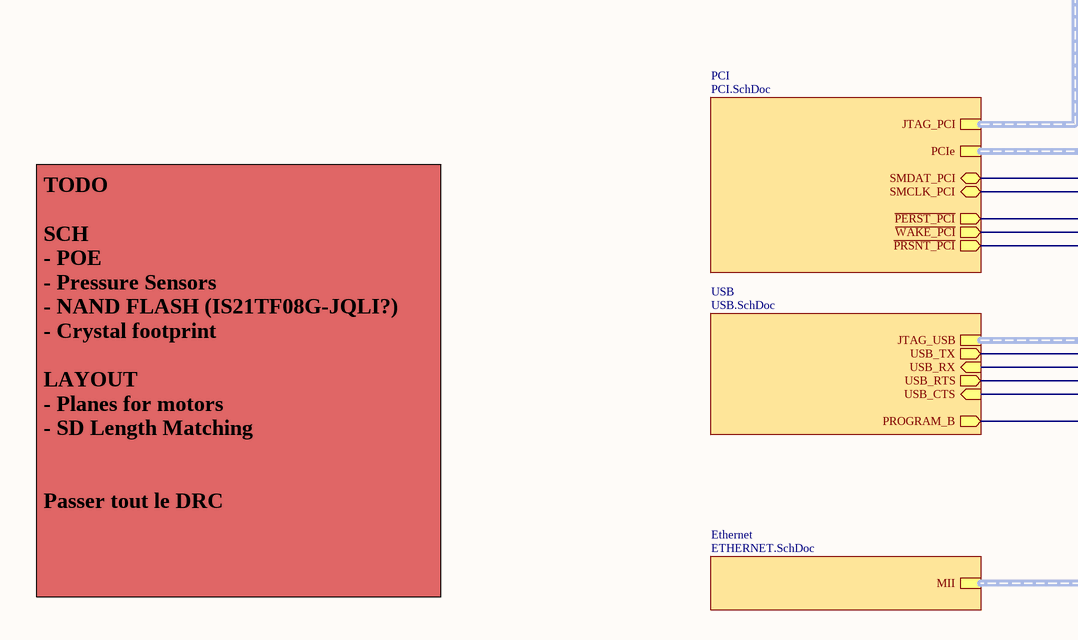
[diagram p5: OVERVIEW.SchDoc, top left]
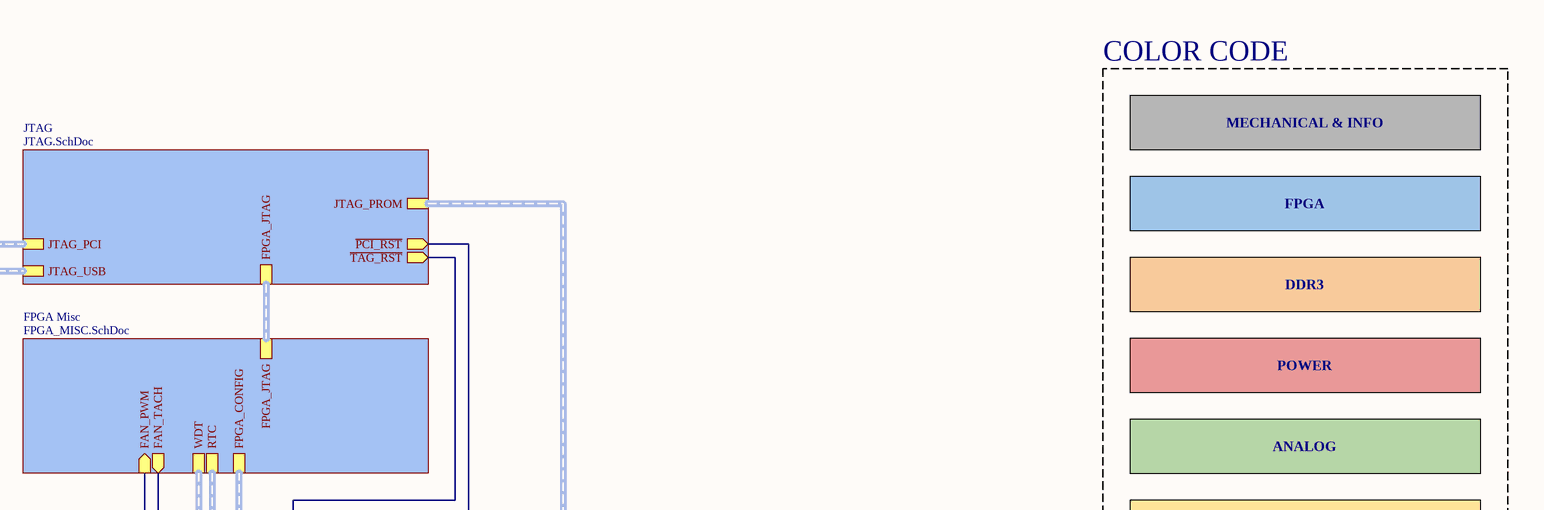
[diagram p6: OVERVIEW.SchDoc, top right]
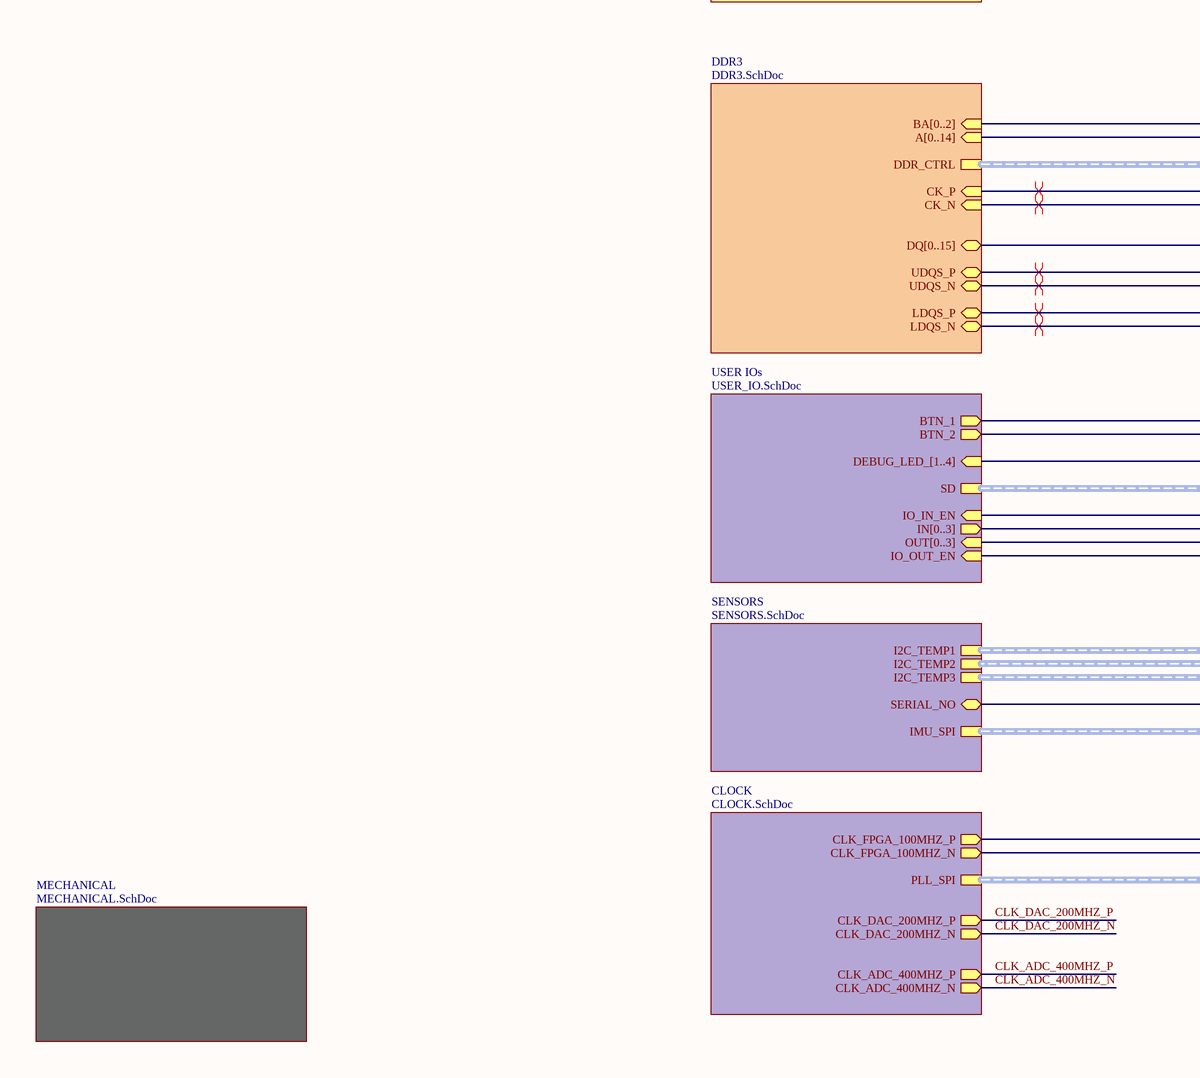
[diagram p7: OVERVIEW.SchDoc, bottom left]
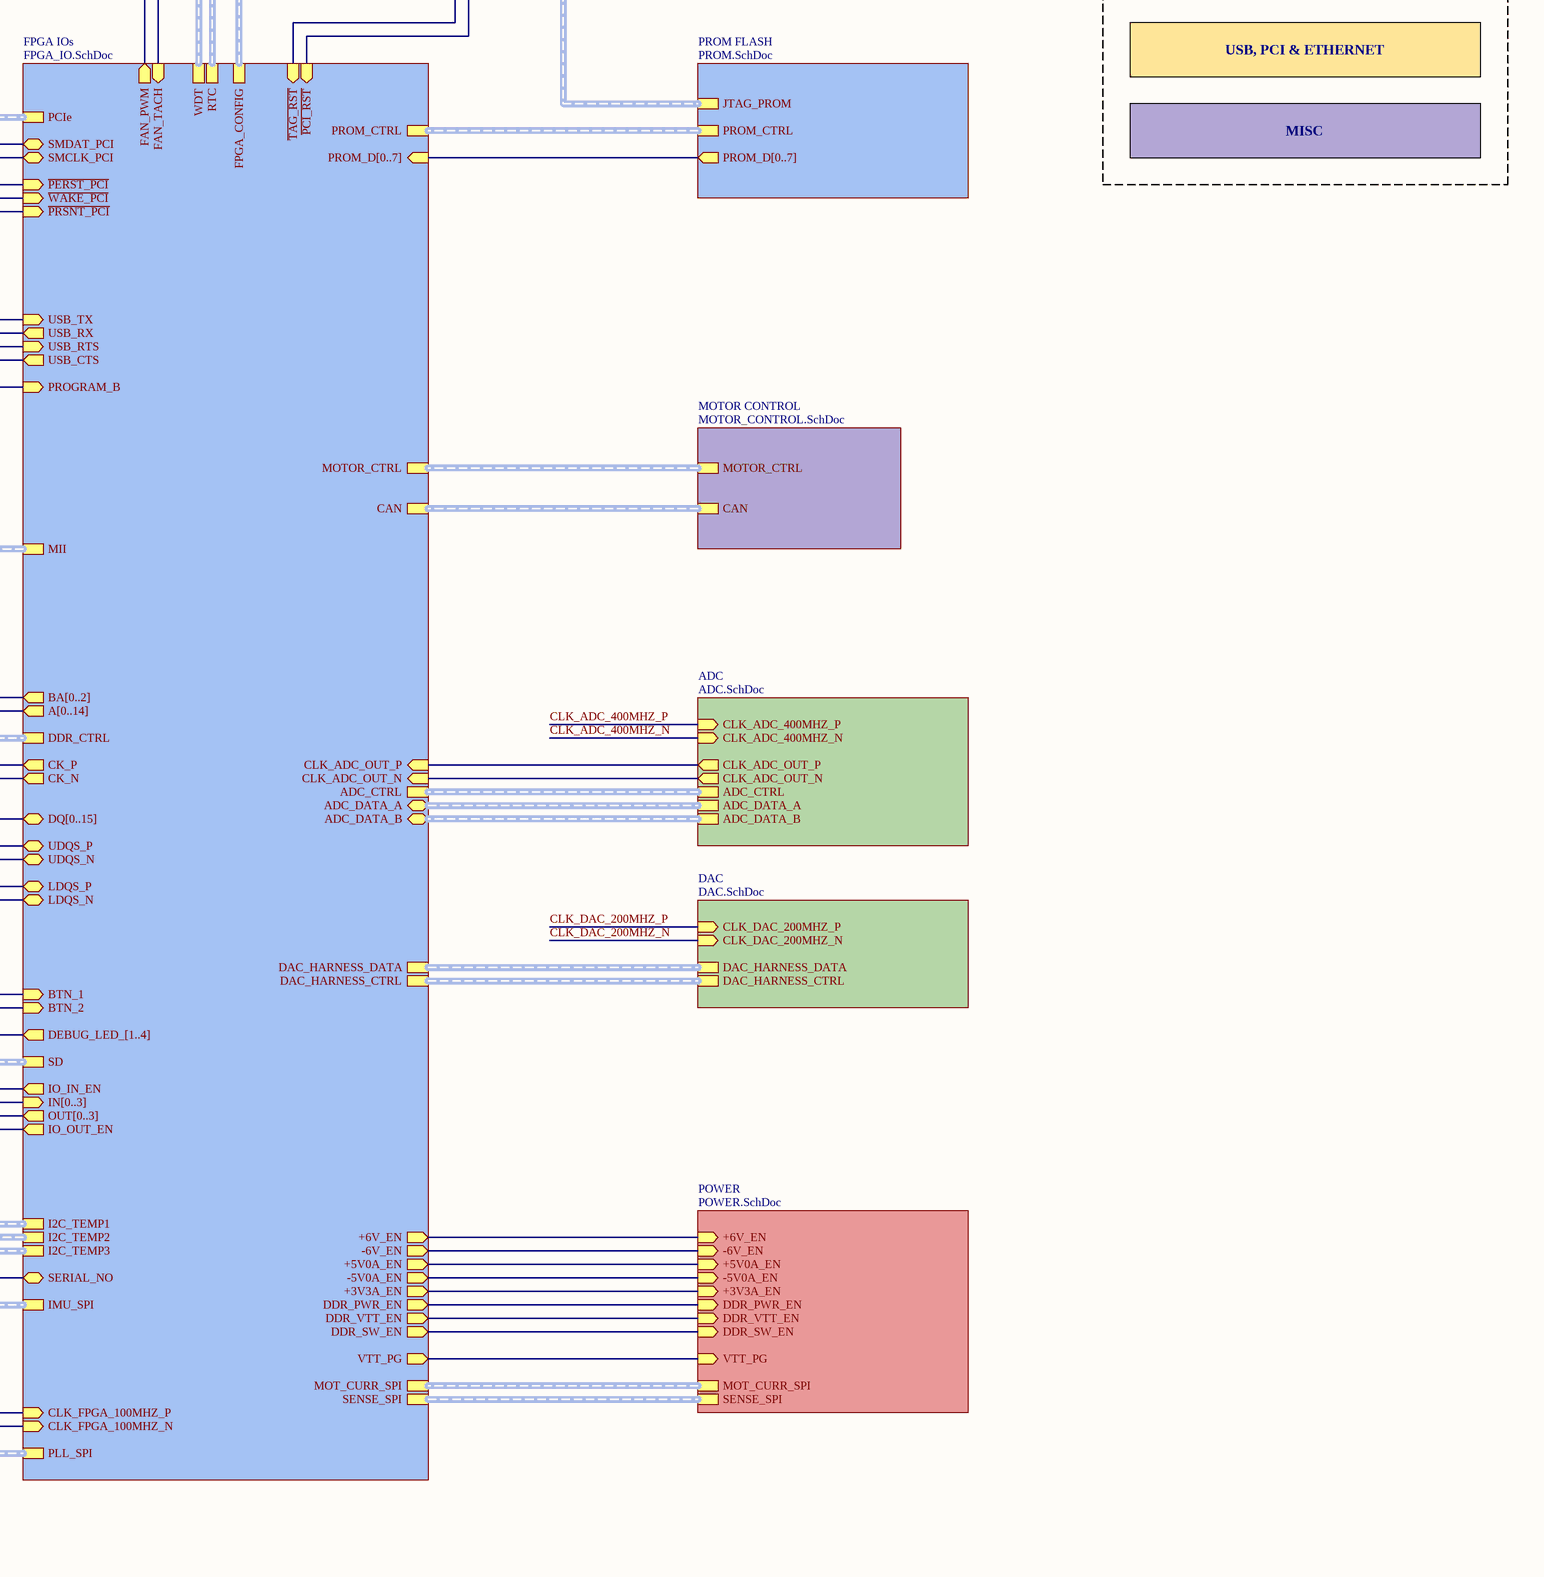
[diagram p8: OVERVIEW.SchDoc, bottom right]

### Sub-sheets
ADC = ADC.SchDoc: ADC_DATA_A (harness ADC_DATA_A), ADC_DATA_B (harness ADC_DATA_B), CLK_ADC_400MHZ_P (in), CLK_ADC_400MHZ_N (in), CLK_ADC_OUT_P (out), CLK_ADC_OUT_N (out), ADC_CTRL (harness ADC_CTRL)
CLOCK = CLOCK.SchDoc: PLL_SPI (harness PLL_HARNESS), CLK_FPGA_100MHZ_P (out), CLK_FPGA_100MHZ_N (out), CLK_DAC_200MHZ_P (out), CLK_DAC_200MHZ_N (out), CLK_ADC_400MHZ_P (out), CLK_ADC_400MHZ_N (out)
DAC = DAC.SchDoc: DAC_HARNESS_DATA (harness DAC_HARNESS_DATA), DAC_HARNESS_CTRL (harness DAC_HARNESS_CTRL), CLK_DAC_200MHZ_P (in), CLK_DAC_200MHZ_N (in)
DDR3 = DDR3.SchDoc: A[0..14] (in), DDR_CTRL (harness DDR3_HARNESS), BA[0..2] (in), DQ[0..15] (bidir), CK_P (in), CK_N (in), UDQS_P (bidir), UDQS_N (bidir), LDQS_P (bidir), LDQS_N (bidir)
Ethernet = ETHERNET.SchDoc: MII (harness ETHERNET_HARNESS)
FPGA IOs = FPGA_IO.SchDoc: BA[0..2] (out), CK_P (out), CK_N (out), UDQS_P (bidir), UDQS_N (bidir), LDQS_P (bidir), LDQS_N (bidir), BTN_1 (in), BTN_2 (in), CLK_FPGA_100MHZ_N (in), CLK_FPGA_100MHZ_P (in), ADC_DATA_A (bidir, harness ADC_DATA_A), DAC_HARNESS_DATA (harness DAC_HARNESS_DATA), DAC_HARNESS_CTRL (harness DAC_HARNESS_CTRL), ADC_DATA_B (bidir, harness ADC_DATA_B), USB_TX (in), USB_RX (out), USB_RTS (in), USB_CTS (out), CLK_ADC_OUT_P (in), CLK_ADC_OUT_N (in), A[0..14] (out), DQ[0..15] (bidir), DDR_CTRL (harness DDR3_HARNESS), MOTOR_CTRL (harness MOTOR_CTRL_HARNESS), PROM_D[0..7] (in), ADC_CTRL (harness ADC_CTRL), MII (harness ETHERNET_HARNESS), PLL_SPI (harness PLL_HARNESS), PROM_CTRL (harness PROM_HARNESS), DDR_SW_EN (out), VTT_PG (out), DDR_VTT_EN (out), DDR_PWR_EN (out), +5V0A_EN (out), -5V0A_EN (out), -6V_EN (out), +3V3A_EN (out), +6V_EN (out), FPGA_CONFIG (harness FPGA_CONFIG_HARNESS), SENSE_SPI (harness SENSE_SPI), DEBUG_LED_[1..4] (out), I2C_TEMP1 (harness I2C_HARNESS), I2C_TEMP2 (harness I2C_HARNESS), I2C_TEMP3 (harness I2C_HARNESS), PROGRAM_B (in), MOT_CURR_SPI (harness MOT_CURR_SPI), SD (harness SD_CARD_HARNESS), SERIAL_NO (bidir), ~{WAKE_PCI} (in), ~{PERST_PCI} (in), SMCLK_PCI (bidir), SMDAT_PCI (bidir), WDT (harness FPGA_WDT_HARNESS), ~{PCI_RST} (in), ~{TAG_RST} (in), PCIe (harness PCI_HARNESS), FAN_PWM (out), FAN_TACH (in), ~{PRSNT_PCI} (in), CAN (harness CAN_HARNESS), IN[0..3] (in), OUT[0..3] (out), IMU_SPI (harness IMU_HARNESS), RTC (harness RTC_HARNESS), IO_IN_EN (out), IO_OUT_EN (out)
FPGA Misc = FPGA_MISC.SchDoc: FPGA_CONFIG (harness FPGA_CONFIG_HARNESS), WDT (harness FPGA_WDT_HARNESS), FAN_PWM (in), FAN_TACH (out), FPGA_JTAG (harness JTAG_HARNESS), RTC (harness RTC_HARNESS)
JTAG = JTAG.SchDoc: ~{PCI_RST} (out), ~{TAG_RST} (out), JTAG_USB (harness JTAG_USB_HARNESS), JTAG_PROM (harness JTAG_HARNESS), JTAG_PCI (harness JTAG_PCI_HARNESS), FPGA_JTAG (harness JTAG_HARNESS)
MECHANICAL = MECHANICAL.SchDoc: no entries
MOTOR CONTROL = MOTOR_CONTROL.SchDoc: MOTOR_CTRL (harness MOTOR_CTRL_HARNESS), CAN (harness CAN_HARNESS)
PCI = PCI.SchDoc: ~{WAKE_PCI} (out), ~{PERST_PCI} (out), JTAG_PCI (harness JTAG_PCI_HARNESS), SMCLK_PCI (bidir), SMDAT_PCI (bidir), PCIe (harness PCI_HARNESS), ~{PRSNT_PCI} (out)
POWER = POWER.SchDoc: +3V3A_EN (in), -6V_EN (in), +6V_EN (in), -5V0A_EN (in), +5V0A_EN (in), DDR_PWR_EN (in), DDR_SW_EN (in), DDR_VTT_EN (in), VTT_PG (in), SENSE_SPI (harness SENSE_SPI), MOT_CURR_SPI (harness MOT_CURR_SPI)
PROM FLASH = PROM.SchDoc: PROM_CTRL (harness PROM_HARNESS), PROM_D[0..7] (out), JTAG_PROM (harness JTAG_HARNESS)
SENSORS = SENSORS.SchDoc: I2C_TEMP1 (harness I2C_HARNESS), I2C_TEMP2 (harness I2C_HARNESS), I2C_TEMP3 (harness I2C_HARNESS), SERIAL_NO (bidir), IMU_SPI (harness IMU_HARNESS)
USB = USB.SchDoc: JTAG_USB (harness JTAG_USB_HARNESS), USB_TX (out), USB_RX (in), USB_RTS (out), USB_CTS (in), PROGRAM_B (out)
USER IOs = USER_IO.SchDoc: BTN_1 (out), BTN_2 (out), DEBUG_LED_[1..4] (in), SD (harness SD_CARD_HARNESS), IN[0..3] (out), OUT[0..3] (in), IO_IN_EN (in), IO_OUT_EN (in)

### Nets
+3V3A_EN: sheet POWER/+3V3A_EN, sheet FPGA IOs/+3V3A_EN
+5V0A_EN: sheet POWER/+5V0A_EN, sheet FPGA IOs/+5V0A_EN
+6V_EN: sheet POWER/+6V_EN, sheet FPGA IOs/+6V_EN
-5V0A_EN: sheet POWER/-5V0A_EN, sheet FPGA IOs/-5V0A_EN
-6V_EN: sheet POWER/-6V_EN, sheet FPGA IOs/-6V_EN
~{PCI_RST}: sheet FPGA IOs/~{PCI_RST}, sheet JTAG/~{PCI_RST}
~{PERST_PCI}: sheet FPGA IOs/~{PERST_PCI}, sheet PCI/~{PERST_PCI}
~{PRSNT_PCI}: sheet FPGA IOs/~{PRSNT_PCI}, sheet PCI/~{PRSNT_PCI}
~{TAG_RST}: sheet FPGA IOs/~{TAG_RST}, sheet JTAG/~{TAG_RST}
~{WAKE_PCI}: sheet FPGA IOs/~{WAKE_PCI}, sheet PCI/~{WAKE_PCI}
BTN_1: sheet FPGA IOs/BTN_1, sheet USER IOs/BTN_1
BTN_2: sheet FPGA IOs/BTN_2, sheet USER IOs/BTN_2
CK_N: sheet DDR3/CK_N, sheet FPGA IOs/CK_N
CK_P: sheet DDR3/CK_P, sheet FPGA IOs/CK_P
CLK_ADC_400MHZ_N: sheet ADC/CLK_ADC_400MHZ_N, sheet CLOCK/CLK_ADC_400MHZ_N
CLK_ADC_400MHZ_P: sheet ADC/CLK_ADC_400MHZ_P, sheet CLOCK/CLK_ADC_400MHZ_P
CLK_ADC_OUT_N: sheet ADC/CLK_ADC_OUT_N, sheet FPGA IOs/CLK_ADC_OUT_N
CLK_ADC_OUT_P: sheet ADC/CLK_ADC_OUT_P, sheet FPGA IOs/CLK_ADC_OUT_P
CLK_DAC_200MHZ_N: sheet DAC/CLK_DAC_200MHZ_N, sheet CLOCK/CLK_DAC_200MHZ_N
CLK_DAC_200MHZ_P: sheet DAC/CLK_DAC_200MHZ_P, sheet CLOCK/CLK_DAC_200MHZ_P
CLK_FPGA_100MHZ_N: sheet FPGA IOs/CLK_FPGA_100MHZ_N, sheet CLOCK/CLK_FPGA_100MHZ_N
CLK_FPGA_100MHZ_P: sheet FPGA IOs/CLK_FPGA_100MHZ_P, sheet CLOCK/CLK_FPGA_100MHZ_P
DDR_PWR_EN: sheet POWER/DDR_PWR_EN, sheet FPGA IOs/DDR_PWR_EN
DDR_SW_EN: sheet POWER/DDR_SW_EN, sheet FPGA IOs/DDR_SW_EN
DDR_VTT_EN: sheet POWER/DDR_VTT_EN, sheet FPGA IOs/DDR_VTT_EN
FAN_PWM: sheet FPGA Misc/FAN_PWM, sheet FPGA IOs/FAN_PWM
FAN_TACH: sheet FPGA Misc/FAN_TACH, sheet FPGA IOs/FAN_TACH
IO_IN_EN: sheet FPGA IOs/IO_IN_EN, sheet USER IOs/IO_IN_EN
IO_OUT_EN: sheet FPGA IOs/IO_OUT_EN, sheet USER IOs/IO_OUT_EN
LDQS_N: sheet DDR3/LDQS_N, sheet FPGA IOs/LDQS_N
LDQS_P: sheet DDR3/LDQS_P, sheet FPGA IOs/LDQS_P
PROGRAM_B: sheet FPGA IOs/PROGRAM_B, sheet USB/PROGRAM_B
SERIAL_NO: sheet FPGA IOs/SERIAL_NO, sheet SENSORS/SERIAL_NO
SMCLK_PCI: sheet FPGA IOs/SMCLK_PCI, sheet PCI/SMCLK_PCI
SMDAT_PCI: sheet FPGA IOs/SMDAT_PCI, sheet PCI/SMDAT_PCI
UDQS_N: sheet DDR3/UDQS_N, sheet FPGA IOs/UDQS_N
UDQS_P: sheet DDR3/UDQS_P, sheet FPGA IOs/UDQS_P
USB_CTS: sheet FPGA IOs/USB_CTS, sheet USB/USB_CTS
USB_RTS: sheet FPGA IOs/USB_RTS, sheet USB/USB_RTS
USB_RX: sheet FPGA IOs/USB_RX, sheet USB/USB_RX
USB_TX: sheet FPGA IOs/USB_TX, sheet USB/USB_TX
VTT_PG: sheet POWER/VTT_PG, sheet FPGA IOs/VTT_PG

### Buses and harness runs
bus sheet DDR3/A[0..14] = sheet FPGA IOs/A[0..14]
bus sheet DDR3/BA[0..2] = sheet FPGA IOs/BA[0..2]
bus sheet DDR3/DQ[0..15] = sheet FPGA IOs/DQ[0..15]
bus sheet FPGA IOs/DEBUG_LED_[1..4] = sheet USER IOs/DEBUG_LED_[1..4]
bus sheet FPGA IOs/IN[0..3] = sheet USER IOs/IN[0..3]
bus sheet FPGA IOs/OUT[0..3] = sheet USER IOs/OUT[0..3]
bus sheet FPGA IOs/PROM_D[0..7] = sheet PROM FLASH/PROM_D[0..7]
harness sheet ADC/ADC_CTRL = sheet FPGA IOs/ADC_CTRL
harness sheet ADC/ADC_DATA_A = sheet FPGA IOs/ADC_DATA_A
harness sheet ADC/ADC_DATA_B = sheet FPGA IOs/ADC_DATA_B
harness sheet CLOCK/PLL_SPI = sheet FPGA IOs/PLL_SPI
harness sheet DAC/DAC_HARNESS_CTRL = sheet FPGA IOs/DAC_HARNESS_CTRL
harness sheet DAC/DAC_HARNESS_DATA = sheet FPGA IOs/DAC_HARNESS_DATA
harness sheet DDR3/DDR_CTRL = sheet FPGA IOs/DDR_CTRL
harness sheet Ethernet/MII = sheet FPGA IOs/MII
harness sheet FPGA IOs/CAN = sheet MOTOR CONTROL/CAN
harness sheet FPGA IOs/FPGA_CONFIG = sheet FPGA Misc/FPGA_CONFIG
harness sheet FPGA IOs/I2C_TEMP1 = sheet SENSORS/I2C_TEMP1
harness sheet FPGA IOs/I2C_TEMP2 = sheet SENSORS/I2C_TEMP2
harness sheet FPGA IOs/I2C_TEMP3 = sheet SENSORS/I2C_TEMP3
harness sheet FPGA IOs/IMU_SPI = sheet SENSORS/IMU_SPI
harness sheet FPGA IOs/MOT_CURR_SPI = sheet POWER/MOT_CURR_SPI
harness sheet FPGA IOs/MOTOR_CTRL = sheet MOTOR CONTROL/MOTOR_CTRL
harness sheet FPGA IOs/PCIe = sheet PCI/PCIe
harness sheet FPGA IOs/PROM_CTRL = sheet PROM FLASH/PROM_CTRL
harness sheet FPGA IOs/RTC = sheet FPGA Misc/RTC
harness sheet FPGA IOs/SD = sheet USER IOs/SD
harness sheet FPGA IOs/SENSE_SPI = sheet POWER/SENSE_SPI
harness sheet FPGA IOs/WDT = sheet FPGA Misc/WDT
harness sheet FPGA Misc/FPGA_JTAG = sheet JTAG/FPGA_JTAG
harness sheet JTAG/JTAG_PCI = sheet PCI/JTAG_PCI
harness sheet JTAG/JTAG_PROM = sheet PROM FLASH/JTAG_PROM
harness sheet JTAG/JTAG_USB = sheet USB/JTAG_USB

### Layout directives
differential pair: CK_N, CK_P, LDQS_N, LDQS_P, UDQS_N, UDQS_P

### Notes on the sheet
- COLOR CODE
- MECHANICAL & INFO
- FPGA
- DDR3
- POWER
- ANALOG
- USB, PCI & ETHERNET
- MISC
- TODO
  SCH
  - POE
  - Pressure Sensors
  - NAND FLASH (IS21TF08G-JQLI?)
  - Crystal footprint
  LAYOUT
  - Planes for motors
  - SD Length Matching
  Passer tout le DRC
- Sheet Name
- Project Title
- Global Project
- Revision
- Size
- Date
- Group
- Sheet
- of
- Filename
- Designers

## Sheet MECHANICAL.SchDoc
size Letter; SheetNumber: 4; SheetTotal: 23; Sheet_Name: MECHANICAL; Size: 11x17
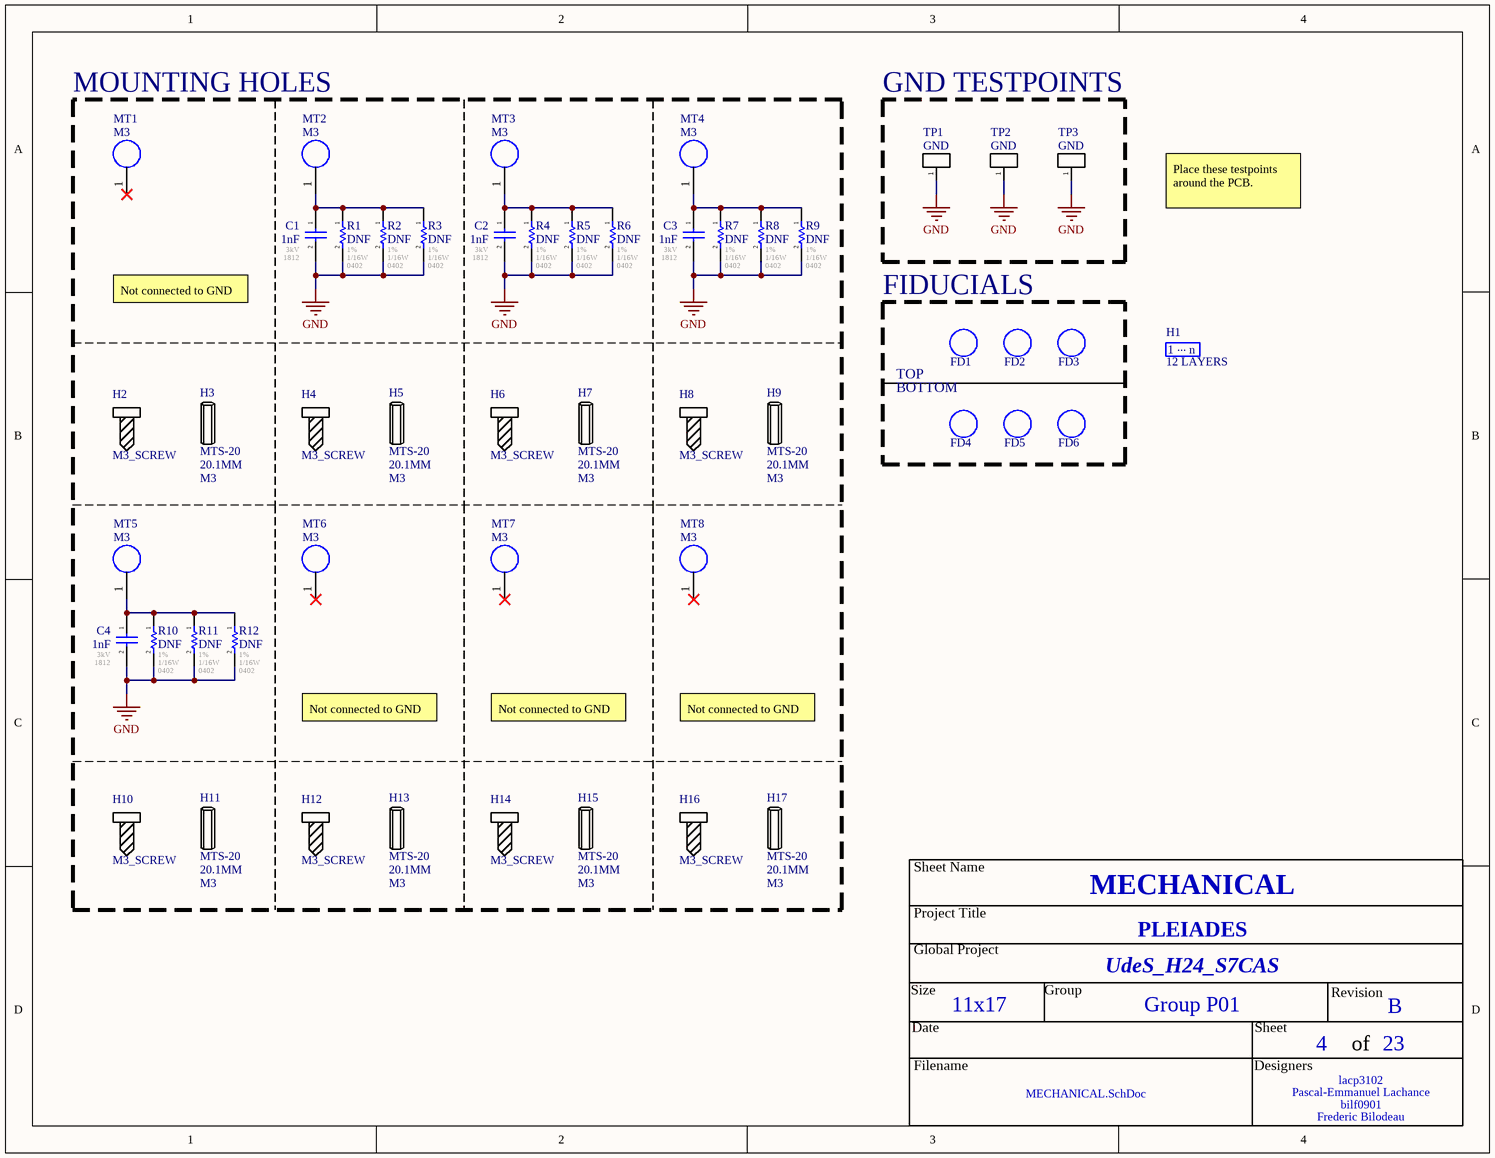
[diagram p9: MECHANICAL.SchDoc]

### Parts
C1  1nF  Voltage - Rated: 3kV  Footprint: 1812  [CAP_1812]
C2  1nF  Voltage - Rated: 3kV  Footprint: 1812  [CAP_1812]
C3  1nF  Voltage - Rated: 3kV  Footprint: 1812  [CAP_1812]
C4  1nF  Voltage - Rated: 3kV  Footprint: 1812  [CAP_1812]
FD1  FIDUCIAL  [FIDUCIAL]  (value not drawn)  (no BOM)
FD2  FIDUCIAL  [FIDUCIAL]  (value not drawn)  (no BOM)
FD3  FIDUCIAL  [FIDUCIAL]  (value not drawn)  (no BOM)
FD4  FIDUCIAL  [FIDUCIAL]  (value not drawn)  (no BOM)
FD5  FIDUCIAL  [FIDUCIAL]  (value not drawn)  (no BOM)
FD6  FIDUCIAL  [FIDUCIAL]  (value not drawn)  (no BOM)
H1  12 LAYERS  [LAYERS_12]  (no BOM)
H2  M3_SCREW  (mechanical)
H3  MTS-20  Length: 20.1MM  Thread Size: M3  [STANDOFF_MTS-20]
H4  M3_SCREW  (mechanical)
H5  MTS-20  Length: 20.1MM  Thread Size: M3  [STANDOFF_MTS-20]
H6  M3_SCREW  (mechanical)
H7  MTS-20  Length: 20.1MM  Thread Size: M3  [STANDOFF_MTS-20]
H8  M3_SCREW  (mechanical)
H9  MTS-20  Length: 20.1MM  Thread Size: M3  [STANDOFF_MTS-20]
H10  M3_SCREW  (mechanical)
H11  MTS-20  Length: 20.1MM  Thread Size: M3  [STANDOFF_MTS-20]
H12  M3_SCREW  (mechanical)
H13  MTS-20  Length: 20.1MM  Thread Size: M3  [STANDOFF_MTS-20]
H14  M3_SCREW  (mechanical)
H15  MTS-20  Length: 20.1MM  Thread Size: M3  [STANDOFF_MTS-20]
H16  M3_SCREW  (mechanical)
H17  MTS-20  Length: 20.1MM  Thread Size: M3  [STANDOFF_MTS-20]
MT1  M3  [MTH_M3]
MT2  M3  [MTH_M3]
MT3  M3  [MTH_M3]
MT4  M3  [MTH_M3]
MT5  M3  [MTH_M3]
MT6  M3  [MTH_M3]
MT7  M3  [MTH_M3]
MT8  M3  [MTH_M3]
R1  DNF  Tolerance: 1%  Power: 1/16W  Package / Case: 0402  [RES_0402]
R2  DNF  Tolerance: 1%  Power: 1/16W  Package / Case: 0402  [RES_0402]
R3  DNF  Tolerance: 1%  Power: 1/16W  Package / Case: 0402  [RES_0402]
R4  DNF  Tolerance: 1%  Power: 1/16W  Package / Case: 0402  [RES_0402]
R5  DNF  Tolerance: 1%  Power: 1/16W  Package / Case: 0402  [RES_0402]
R6  DNF  Tolerance: 1%  Power: 1/16W  Package / Case: 0402  [RES_0402]
R7  DNF  Tolerance: 1%  Power: 1/16W  Package / Case: 0402  [RES_0402]
R8  DNF  Tolerance: 1%  Power: 1/16W  Package / Case: 0402  [RES_0402]
R9  DNF  Tolerance: 1%  Power: 1/16W  Package / Case: 0402  [RES_0402]
R10  DNF  Tolerance: 1%  Power: 1/16W  Package / Case: 0402  [RES_0402]
R11  DNF  Tolerance: 1%  Power: 1/16W  Package / Case: 0402  [RES_0402]
R12  DNF  Tolerance: 1%  Power: 1/16W  Package / Case: 0402  [RES_0402]
TP1  GND  [TP_HOLE]  (no BOM)
TP2  GND  [TP_HOLE]  (no BOM)
TP3  GND  [TP_HOLE]  (no BOM)

### Blocks framed on the sheet
MOUNTING HOLES: C1-C4 H2-H17 MT1-MT8 R1-R12
GND TESTPOINTS: TP1-TP3
FIDUCIALS: FD1-FD6

### Nets
GND: C1.2 C2.2 C3.2 C4.2 R1.2 R2.2 R3.2 R4.2 R5.2 R6.2 R7.2 R8.2 R9.2 R10.2 R11.2 R12.2 TP1.1(A) TP2.1(A) TP3.1(A)
NetC1_1: C1.1 MT2.1 R1.1 R2.1 R3.1
NetC2_1: C2.1 MT3.1 R4.1 R5.1 R6.1
NetC3_1: C3.1 MT4.1 R7.1 R8.1 R9.1
NetC4_1: C4.1 MT5.1 R10.1 R11.1 R12.1

Not connected (* = marked no-connect by the designer): MT1 1*; MT6 1*; MT7 1*; MT8 1*

### Notes on the sheet
- Place these testpoints around the PCB.
- Not connected to GND
- (near FD4) BOTTOM
- TOP
- Sheet Name
- Project Title
- Global Project
- Revision
- Size
- Date
- Group
- Sheet
- of
- Filename
- Designers
- (in symbol MECH_LAYER_MARKER) 1; ...; n

### Library data of the parts
C1-C4 = CAP_CER: as CX15 on sheet INFO; Operating Temperature: -55C - 125C; Temperature Coefficient: X7R; ComponentLink1Description: Digikey; ComponentLink1URL: https://www.digikey.com/en/products/detail/kemet/C1812C102KHRACAUTO/8109956; Part#: C1812C102KHRACAUTO; ComponentLink2Description: Datasheet; ComponentLink2URL: https://connect.kemet.com:7667/gateway/IntelliData-ComponentDocumentation/1.0/download/datasheet/C1812C102KHRACAUTO; Tolerance: 10%; Ratings: AEC-Q200; ComponentLink3Description: KEMET; ComponentLink3URL: https://www.kemet.com/en/us/capacitors/ceramic/product/C1812C102KHRACAUTO.html; ComponentLink4Description: Octopart; ComponentLink4URL: https://octopart.com/c1812c102khracauto-kemet-67309371?r=sp; Features: Low ESL, High Voltage; Supplier 1: Mouser; Supplier Part Number 1: 80-C1812C102KHRAUTO
H1 = MECH_LAYER_MARKER
H3 H5 H7 H9 H11 H13 H15 H17 = M3_STANDOFF: Material: *; ComponentLink1Description: Digikey; ComponentLink1URL: https://www.digikey.ca/en/products/detail/essentra-components/mts-20/392825; ComponentLink2Description: Mfr; ComponentLink2URL: https://www.essentracomponents.com/en-ca/p/pcb-standoffs-hexagonal-metric-imperial-threaded-plastic/mts-20; Supplier 1: Digikey; Supplier Part Number 1: RPC1573-ND
MT1-MT8 = MOUNTING_HOLE
R1-R12 = RESISTOR: Automotive: AEC-Q200; Operating Temperature: *; # Digikey: *; ComponentLink1Description: Digikey; ComponentLink1URL: *; # Manufacturer: *
TP1-TP3 = TESTPOINT: Test Point; ClassName: Testpoint